# Altium project Sitara_Project_Rev_A.PrjPcb (part 2 of 3)

## Sheet Sitara_IO_Bank_123.SchDoc
size A3; SheetNumber: 7; SheetTotal: 11
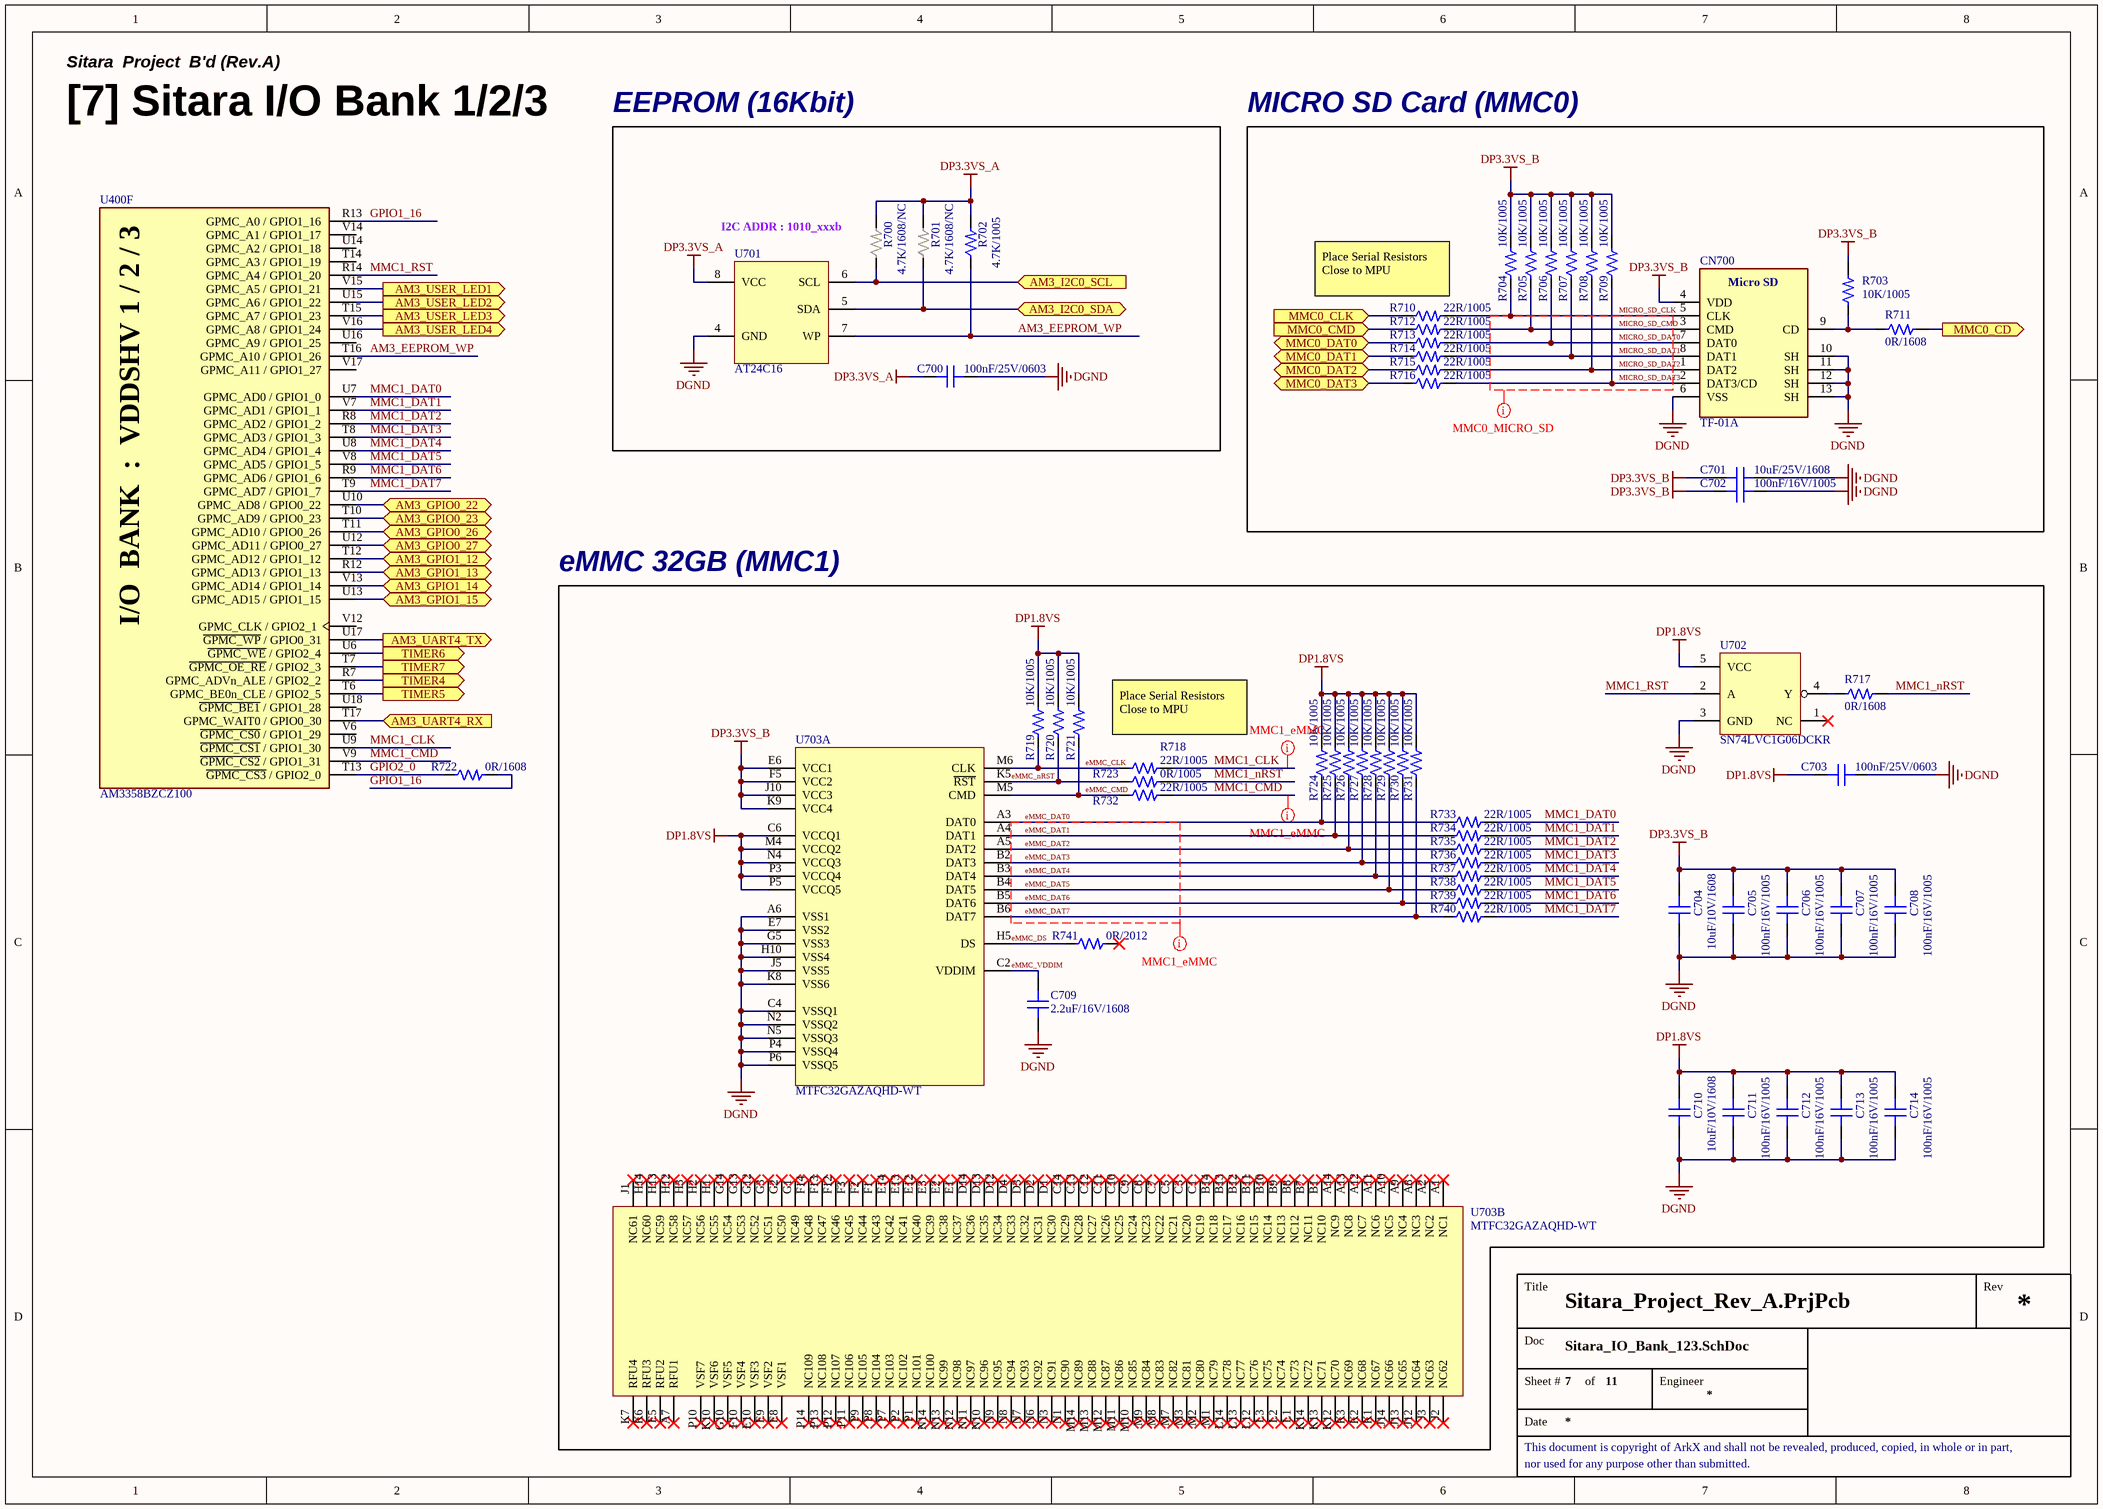
[diagram p6: Sitara_IO_Bank_123.SchDoc]

### Parts
C700  100nF/25V/0603  [CAP 0603 (0201_INCH)]
C701  10uF/25V/1608  [CAP 1608 (0603_INCH)]
C702  100nF/16V/1005  [CAP 1005 (0402_INCH)]
C703  100nF/25V/0603  [CAP 0603 (0201_INCH)]
C704  10uF/10V/1608  [CAP 1608 (0603_INCH)]
C705  100nF/16V/1005  [CAP 1005 (0402_INCH)]
C706  100nF/16V/1005  [CAP 1005 (0402_INCH)]
C707  100nF/16V/1005  [CAP 1005 (0402_INCH)]
C708  100nF/16V/1005  [CAP 1005 (0402_INCH)]
C709  2.2uF/16V/1608  [CAP 1608 (0603_INCH)]
C710  10uF/10V/1608  [CAP 1608 (0603_INCH)]
C711  100nF/16V/1005  [CAP 1005 (0402_INCH)]
C712  100nF/16V/1005  [CAP 1005 (0402_INCH)]
C713  100nF/16V/1005  [CAP 1005 (0402_INCH)]
C714  100nF/16V/1005  [CAP 1005 (0402_INCH)]
CN700  TF-01A  [CON_MICRO-SD_Socket_TF-01A]
R700  4.7K/1608/NC  [RES 1608 (0603_inch)/NC]
R701  4.7K/1608/NC  [RES 1608 (0603_inch)/NC]
R702  4.7K/1005  [RES 1005 (0402_inch)]
R703  10K/1005  [RES 1005 (0402_inch)]
R704  10K/1005  [RES 1005 (0402_inch)]
R705  10K/1005  [RES 1005 (0402_inch)]
R706  10K/1005  [RES 1005 (0402_inch)]
R707  10K/1005  [RES 1005 (0402_inch)]
R708  10K/1005  [RES 1005 (0402_inch)]
R709  10K/1005  [RES 1005 (0402_inch)]
R710  22R/1005  [RES 1005 (0402_inch)]
R711  0R/1608  [RES 1608 (0603_inch)]
R712  22R/1005  [RES 1005 (0402_inch)]
R713  22R/1005  [RES 1005 (0402_inch)]
R714  22R/1005  [RES 1005 (0402_inch)]
R715  22R/1005  [RES 1005 (0402_inch)]
R716  22R/1005  [RES 1005 (0402_inch)]
R717  0R/1608  [RES 1608 (0603_inch)]
R718  22R/1005  [RES 1005 (0402_inch)]
R719  10K/1005  [RES 1005 (0402_inch)]
R720  10K/1005  [RES 1005 (0402_inch)]
R721  10K/1005  [RES 1005 (0402_inch)]
R722  0R/1608  [RES 1608 (0603_inch)]
R723  0R/1005  [RES 1005 (0402_inch)]
R724  10K/1005  [RES 1005 (0402_inch)]
R725  10K/1005  [RES 1005 (0402_inch)]
R726  10K/1005  [RES 1005 (0402_inch)]
R727  10K/1005  [RES 1005 (0402_inch)]
R728  10K/1005  [RES 1005 (0402_inch)]
R729  10K/1005  [RES 1005 (0402_inch)]
R730  10K/1005  [RES 1005 (0402_inch)]
R731  10K/1005  [RES 1005 (0402_inch)]
R732  22R/1005  [RES 1005 (0402_inch)]
R733  22R/1005  [RES 1005 (0402_inch)]
R734  22R/1005  [RES 1005 (0402_inch)]
R735  22R/1005  [RES 1005 (0402_inch)]
R736  22R/1005  [RES 1005 (0402_inch)]
R737  22R/1005  [RES 1005 (0402_inch)]
R738  22R/1005  [RES 1005 (0402_inch)]
R739  22R/1005  [RES 1005 (0402_inch)]
R740  22R/1005  [RES 1005 (0402_inch)]
R741  0R/2012  [RES 2012 (0805_inch)]
U400  AM3358BZCZ100  [IC_SOC_AM3358BZCZ100]  (part F of 8)
U701  AT24C16  [TSSOP-8_PW (TI)]
U702  SN74LVC1G06DCKR  [IC_SC-70-5]
U703  MTFC32GAZAQHD-WT  [IC_VFBGA-153]  (parts A,B of 2)

### Blocks framed on the sheet
EEPROM (16Kbit): C700 R700-R702 U701
MICRO SD Card (MMC0): C701 C702 CN700 R703-R716
eMMC 32GB (MMC1): C703-C714 R717-R721 R723-R741 U702 U703

### Ports
AM3_GPIO0_22 (bidir), AM3_GPIO0_23 (bidir), AM3_GPIO0_26 (bidir), AM3_GPIO0_27 (bidir), AM3_GPIO1_12 (bidir), AM3_GPIO1_13 (bidir), AM3_GPIO1_14 (bidir), AM3_GPIO1_15 (bidir), AM3_I2C0_SCL (in), AM3_I2C0_SDA (bidir), AM3_UART4_RX (in), AM3_UART4_TX (out), AM3_USER_LED1 (out), AM3_USER_LED2 (out), AM3_USER_LED3 (out), AM3_USER_LED4 (out), MMC0_CD (out), MMC0_CLK (in), MMC0_CMD (in), MMC0_DAT0 (bidir), MMC0_DAT1 (bidir), MMC0_DAT2 (bidir), MMC0_DAT3 (bidir), TIMER4 (out), TIMER5 (out), TIMER6 (out), TIMER7 (out)

### Nets
DGND: C700.2 C701.2 C702.1 C703.1 C704.1 C705.1 C706.1 C707.1 C708.1 C709.1 C710.1 C711.1 C712.1 C713.1 C714.1 CN700.6(VSS) CN700.10(SH) CN700.11(SH) CN700.12(SH) CN700.13(SH) U701.4(GND) U702.3(GND) U703.A6(VSS1) U703.C4(VSSQ1) U703.E7(VSS2) U703.G5(VSS3) U703.H10(VSS4) U703.J5(VSS5) U703.K8(VSS6) U703.N2(VSSQ2) U703.N5(VSSQ3) U703.P4(VSSQ4) U703.P6(VSSQ5)
DP1.8VS: C703.2 C710.2 C711.2 C712.2 C713.2 C714.2 R719.2 R720.2 R721.2 R724.2 R725.2 R726.2 R727.2 R728.2 R729.2 R730.2 R731.2 U702.5(VCC) U703.C6(VCCQ1) U703.M4(VCCQ2) U703.N4(VCCQ3) U703.P3(VCCQ4) U703.P5(VCCQ5)
DP3.3VS_A: C700.1 R700.2 R701.2 R702.2 U701.8(VCC)
DP3.3VS_B: C701.1 C702.2 C704.2 C705.2 C706.2 C707.2 C708.2 CN700.4(VDD) R703.2 R704.2 R705.2 R706.2 R707.2 R708.2 R709.2 U703.E6(VCC1) U703.F5(VCC2) U703.J10(VCC3) U703.K9(VCC4)
AM3_EEPROM_WP: R702.1 U400.T16(GPMC_A10_/_GPIO1_26) U701.7(WP)
AM3_GPIO0_22: U400.U10(GPMC_AD8_/_GPIO0_22) ; port AM3_GPIO0_22
AM3_GPIO0_23: U400.T10(GPMC_AD9_/_GPIO0_23) ; port AM3_GPIO0_23
AM3_GPIO0_26: U400.T11(GPMC_AD10_/_GPIO0_26) ; port AM3_GPIO0_26
AM3_GPIO0_27: U400.U12(GPMC_AD11_/_GPIO0_27) ; port AM3_GPIO0_27
AM3_GPIO1_12: U400.T12(GPMC_AD12_/_GPIO1_12) ; port AM3_GPIO1_12
AM3_GPIO1_13: U400.R12(GPMC_AD13_/_GPIO1_13) ; port AM3_GPIO1_13
AM3_GPIO1_14: U400.V13(GPMC_AD14_/_GPIO1_14) ; port AM3_GPIO1_14
AM3_GPIO1_15: U400.U13(GPMC_AD15_/_GPIO1_15) ; port AM3_GPIO1_15
AM3_I2C0_SCL: R700.1 U701.6(SCL) ; port AM3_I2C0_SCL
AM3_I2C0_SDA: R701.1 U701.5(SDA) ; port AM3_I2C0_SDA
AM3_UART4_RX: U400.T17(GPMC_WAIT0_/_GPIO0_30) ; port AM3_UART4_RX
AM3_UART4_TX: U400.U17(~{GPMC_WP}_/_GPIO0_31) ; port AM3_UART4_TX
AM3_USER_LED1: U400.V15(GPMC_A5_/_GPIO1_21) ; port AM3_USER_LED1
AM3_USER_LED2: U400.U15(GPMC_A6_/_GPIO1_22) ; port AM3_USER_LED2
AM3_USER_LED3: U400.T15(GPMC_A7_/_GPIO1_23) ; port AM3_USER_LED3
AM3_USER_LED4: U400.V16(GPMC_A8_/_GPIO1_24) ; port AM3_USER_LED4
eMMC_CLK: R718.1 R719.1 U703.M6(CLK)
eMMC_CMD: R721.1 R732.1 U703.M5(CMD)
eMMC_DAT0: R724.1 R733.1 U703.A3(DAT0)
eMMC_DAT1: R725.1 R734.1 U703.A4(DAT1)
eMMC_DAT2: R726.1 R735.1 U703.A5(DAT2)
eMMC_DAT3: R727.1 R736.1 U703.B2(DAT3)
eMMC_DAT4: R728.1 R737.1 U703.B3(DAT4)
eMMC_DAT5: R729.1 R738.1 U703.B4(DAT5)
eMMC_DAT6: R730.1 R739.1 U703.B5(DAT6)
eMMC_DAT7: R731.1 R740.1 U703.B6(DAT7)
eMMC_DS: R741.1 U703.H5(DS)
eMMC_nRST: R720.1 R723.1 U703.K5(~{RST})
eMMC_VDDIM: C709.2 U703.C2(VDDIM)
GPIO1_16: R722.2 U400.R13(GPMC_A0_/_GPIO1_16)
GPIO2_0: R722.1 U400.T13(~{GPMC_CS3}_/_GPIO2_0)
MICRO_SD_CLK: CN700.5(CLK) R704.1 R710.2
MICRO_SD_CMD: CN700.3(CMD) R705.1 R712.2
MICRO_SD_DAT0: CN700.7(DAT0) R706.1 R713.2
MICRO_SD_DAT1: CN700.8(DAT1) R707.1 R714.2
MICRO_SD_DAT2: CN700.1(DAT2) R708.1 R715.2
MICRO_SD_DAT3: CN700.2(DAT3/CD) R709.1 R716.2
MMC0_CD: R711.2 ; port MMC0_CD
MMC0_CLK: R710.1 ; port MMC0_CLK
MMC0_CMD: R712.1 ; port MMC0_CMD
MMC0_DAT0: R713.1 ; port MMC0_DAT0
MMC0_DAT1: R714.1 ; port MMC0_DAT1
MMC0_DAT2: R715.1 ; port MMC0_DAT2
MMC0_DAT3: R716.1 ; port MMC0_DAT3
MMC1_CLK: R718.2 U400.U9(~{GPMC_CS1}_/_GPIO1_30)
MMC1_CMD: R732.2 U400.V9(~{GPMC_CS2}_/_GPIO1_31)
MMC1_DAT0: R733.2 U400.U7(GPMC_AD0_/_GPIO1_0)
MMC1_DAT1: R734.2 U400.V7(GPMC_AD1_/_GPIO1_1)
MMC1_DAT2: R735.2 U400.R8(GPMC_AD2_/_GPIO1_2)
MMC1_DAT3: R736.2 U400.T8(GPMC_AD3_/_GPIO1_3)
MMC1_DAT4: R737.2 U400.U8(GPMC_AD4_/_GPIO1_4)
MMC1_DAT5: R738.2 U400.V8(GPMC_AD5_/_GPIO1_5)
MMC1_DAT6: R739.2 U400.R9(GPMC_AD6_/_GPIO1_6)
MMC1_DAT7: R740.2 U400.T9(GPMC_AD7_/_GPIO1_7)
MMC1_nRST: R717.2 R723.2
MMC1_RST: U400.R14(GPMC_A4_/_GPIO1_20) U702.2(A)
TIMER4: U400.R7(GPMC_ADVn_ALE_/_GPIO2_2) ; port TIMER4
TIMER5: U400.T6(GPMC_BE0n_CLE_/_GPIO2_5) ; port TIMER5
TIMER6: U400.U6(~{GPMC_WE}_/_GPIO2_4) ; port TIMER6
TIMER7: U400.T7(~{GPMC_OE_RE}_/_GPIO2_3) ; port TIMER7
NetCN700_9: CN700.9(CD) R703.1 R711.1
NetR717_1: R717.1 U702.4(Y)

Not connected (* = marked no-connect by the designer): R741 2*; U400 T14(GPMC_A3_/_GPIO1_19) U14(GPMC_A2_/_GPIO1_18) U16(GPMC_A9_/_GPIO1_25) U18(~{GPMC_BE1}_/_GPIO1_28) V6(~{GPMC_CS0}_/_GPIO1_29) V12(GPMC_CLK_/_GPIO2_1) V14(GPMC_A1_/_GPIO1_17) V17(GPMC_A11_/_GPIO1_27); U702 1(NC)*; U703 A1(NC1)* A2(NC2)* A7(RFU1)* A8(NC3)* A9(NC4)* A10(NC5)* A11(NC6)* A12(NC7)* A13(NC8)* A14(NC9)* B1(NC10)* B7(NC11)* B8(NC12)* B9(NC13)* B10(NC14)* B11(NC15)* B12(NC16)* B13(NC17)* B14(NC18)* C1(NC19)* C3(NC20)* C5(NC21)* C7(NC22)* C8(NC23)* C9(NC24)* C10(NC25)* C11(NC26)* C12(NC27)* C13(NC28)* C14(NC29)* D1(NC30)* D2(NC31)* D3(NC32)* D4(NC33)* D12(NC34)* D13(NC35)* D14(NC36)* E1(NC37)* E2(NC38)* E3(NC39)* E5(RFU2)* E8(VSF1)* E9(VSF2)* E10(VSF3)* E12(NC40)* E13(NC41)* E14(NC42)* F1(NC43)* F2(NC44)* F3(NC45)* F10(VSF4)* F12(NC46)* F13(NC47)* F14(NC48)* G1(NC49)* G2(NC50)* G3(NC51)* G10(VSF5)* G12(NC52)* G13(NC53)* G14(NC54)* H1(NC55)* H2(NC56)* H3(NC57)* H12(NC58)* H13(NC59)* H14(NC60)* J1(NC61)* J2(NC62)* J3(NC63)* J12(NC64)* J13(NC65)* J14(NC66)* K1(NC67)* K2(NC68)* K3(NC69)* K6(RFU3)* K7(RFU4)* K10(VSF6)* K12(NC70)* K13(NC71)* K14(NC72)* L1(NC73)* L2(NC74)* L3(NC75)* L12(NC76)* L13(NC77)* L14(NC78)* M1(NC79)* M2(NC80)* M3(NC81)* M7(NC82)* M8(NC83)* M9(NC84)* M10(NC85)* M11(NC86)* M12(NC87)* M13(NC88)* M14(NC89)* N1(NC90)* N3(NC91)* N6(NC92)* N7(NC93)* N8(NC94)* N9(NC95)* N10(NC96)* N11(NC97)* N12(NC98)* N13(NC99)* N14(NC100)* P1(NC101)* P2(NC102)* P7(NC103)* P8(NC104)* P9(NC105)* P10(VSF7)* P11(NC106)* P12(NC107)* P13(NC108)* P14(NC109)*

### Layout directives
rule Matched Net Lengths [Delay Tolerance = 10ps]; net class MMC0_MICRO_SD: MICRO_SD_CLK, MICRO_SD_CMD, MICRO_SD_DAT0, MICRO_SD_DAT1, MICRO_SD_DAT2, MICRO_SD_DAT3
rule Matched Net Lengths [Delay Tolerance = 10ps]; net class MMC1_eMMC: eMMC_DAT0, eMMC_DAT1, eMMC_DAT2, eMMC_DAT3, eMMC_DAT4, eMMC_DAT5, eMMC_DAT6, eMMC_DAT7, MMC1_CLK, MMC1_CMD

### Notes on the sheet
- Sitara  Project  B'd (Rev.A)
- [7] Sitara I/O Bank 1/2/3
- I2C ADDR : 1010_xxxb
- Place Serial Resistors Close to MPU
- Title
- Rev
- Doc
- Sheet #
- of
- Engineer
- This document is copyright of ArkX and shall not be revealed, produced, copied, in whole or in part,
- Date
- nor used for any purpose other than submitted.
- (in symbol CON_MICRO-SD_Socket_TF-01A) Micro SD
- (in symbol IC_SOC_AM3358BZCZ100, part F) I/O  BANK  :  VDDSHV 1 / 2 / 3

### Library data of the parts
C700 C703 = CAP_100nF/25V/0603: Ceramic CAP_100nF/25V/0603; JLCPCB Part Type: Extended Part; LCSC Part #: C181047
C701 = CAP_10uF/25V/1608: Ceramic CAP_10uF/25V/1608; LCSC Part #: C96446; JLCPCB Part Type: Basic Part
C702 C705-C708 C711-C714 = CAP_100nF/16V/1005: Ceramic CAP_100nF/16V/1005; LCSC Part #: C1525; JLCPCB Part Type: Basic Part
C704 C710 = CAP_10uF/10V/1608: Ceramic CAP_10uF/10V/1608; LCSC Part #: C19702; JLCPCB Part Type: Basic Part
C709 = CAP_2.2uF/16V/1608: Ceramic CAP_2.2uF/16V/1608; LCSC Part #: C23630; JLCPCB Part Type: Basic Part
CN700 = CON_MICRO-SD_Socket_TF-01A: Card Slot MicroSD card (TF card) Self-bouncing SMD SD Card / Memory Card Connector ROHS; LCSC Part #: C91145; JLCPCB Part Type: Extended Part
R700 R701 = RES_NC_4.7K/1608/0.1W: RES_4.7K/1608/0.1W; Value: 4.7K; Power Rating: 0.1W; Precision: 1%; Size: 1608
R702 = RES_4.7K/1005/62.5mW: as R519 on sheet Sitara_AUX; Size: 1005; LCSC Part #: C25900; JLCPCB Part Type: Basic Part
R703-R709 R719-R721 R724-R731 = RES_10K/1005/62.5mW: Value: 10K; Power Rating: 62.5mW; Precision: 1%; Size: 1005; LCSC Part #: C25744; JLCPCB Part Type: Basic Part
R710 R712-R716 R718 R732-R740 = RES_22R/1005/62.5mW: Value: 22R; Power Rating: 62.5mW; Precision: 1%; Size: 1005; LCSC Part #: C25092; JLCPCB Part Type: Basic Part
R711 R717 R722 = RES_0R/1608/0.1W: as R322 on sheet Power; Size: 1608; LCSC Part #: C21189; JLCPCB Part Type: Basic Part
R723 = RES_0R/1005/62.5mW: as R308 on sheet Power; Size: 1005; LCSC Part #: C17168; JLCPCB Part Type: Basic Part
R741 = RES_0R/2012/0.125W: as R310 on sheet Power; Size: 2012; LCSC Part #: C17477; JLCPCB Part Type: Basic Part
U400 = IC_SOC_AM3358BZCZ100: as U400 on sheet Sitara_Power; LCSC Part #: C73932; JLCPCB Part Type: Extended Part
U701 = IC_EEPROM_AT24C16: IC EEPROM 16KBIT I2C 1MHZ 8TSSOP; LCSC Part #: C112954; JLCPCB Part Type: Extended Part
U702 = IC_BUF_SN74LVC1G06DCKR: Inverter IC 1 Channel Open Drain SC-70-5; LCSC Part #: C7828; JLCPCB Part Type: Extended Part
U703 = IC_eMMC_MTFC32GAZAQHD-WT: FLASH - NAND Memory IC 256Gbit MMC 200 MHz 153-VFBGA (11.5x13); LCSC Part #: C5330430; JLCPCB Part Type: Extended Part

## Sheet Sitara_IO_Bank_45.SchDoc
size A3; SheetNumber: 8; SheetTotal: 11
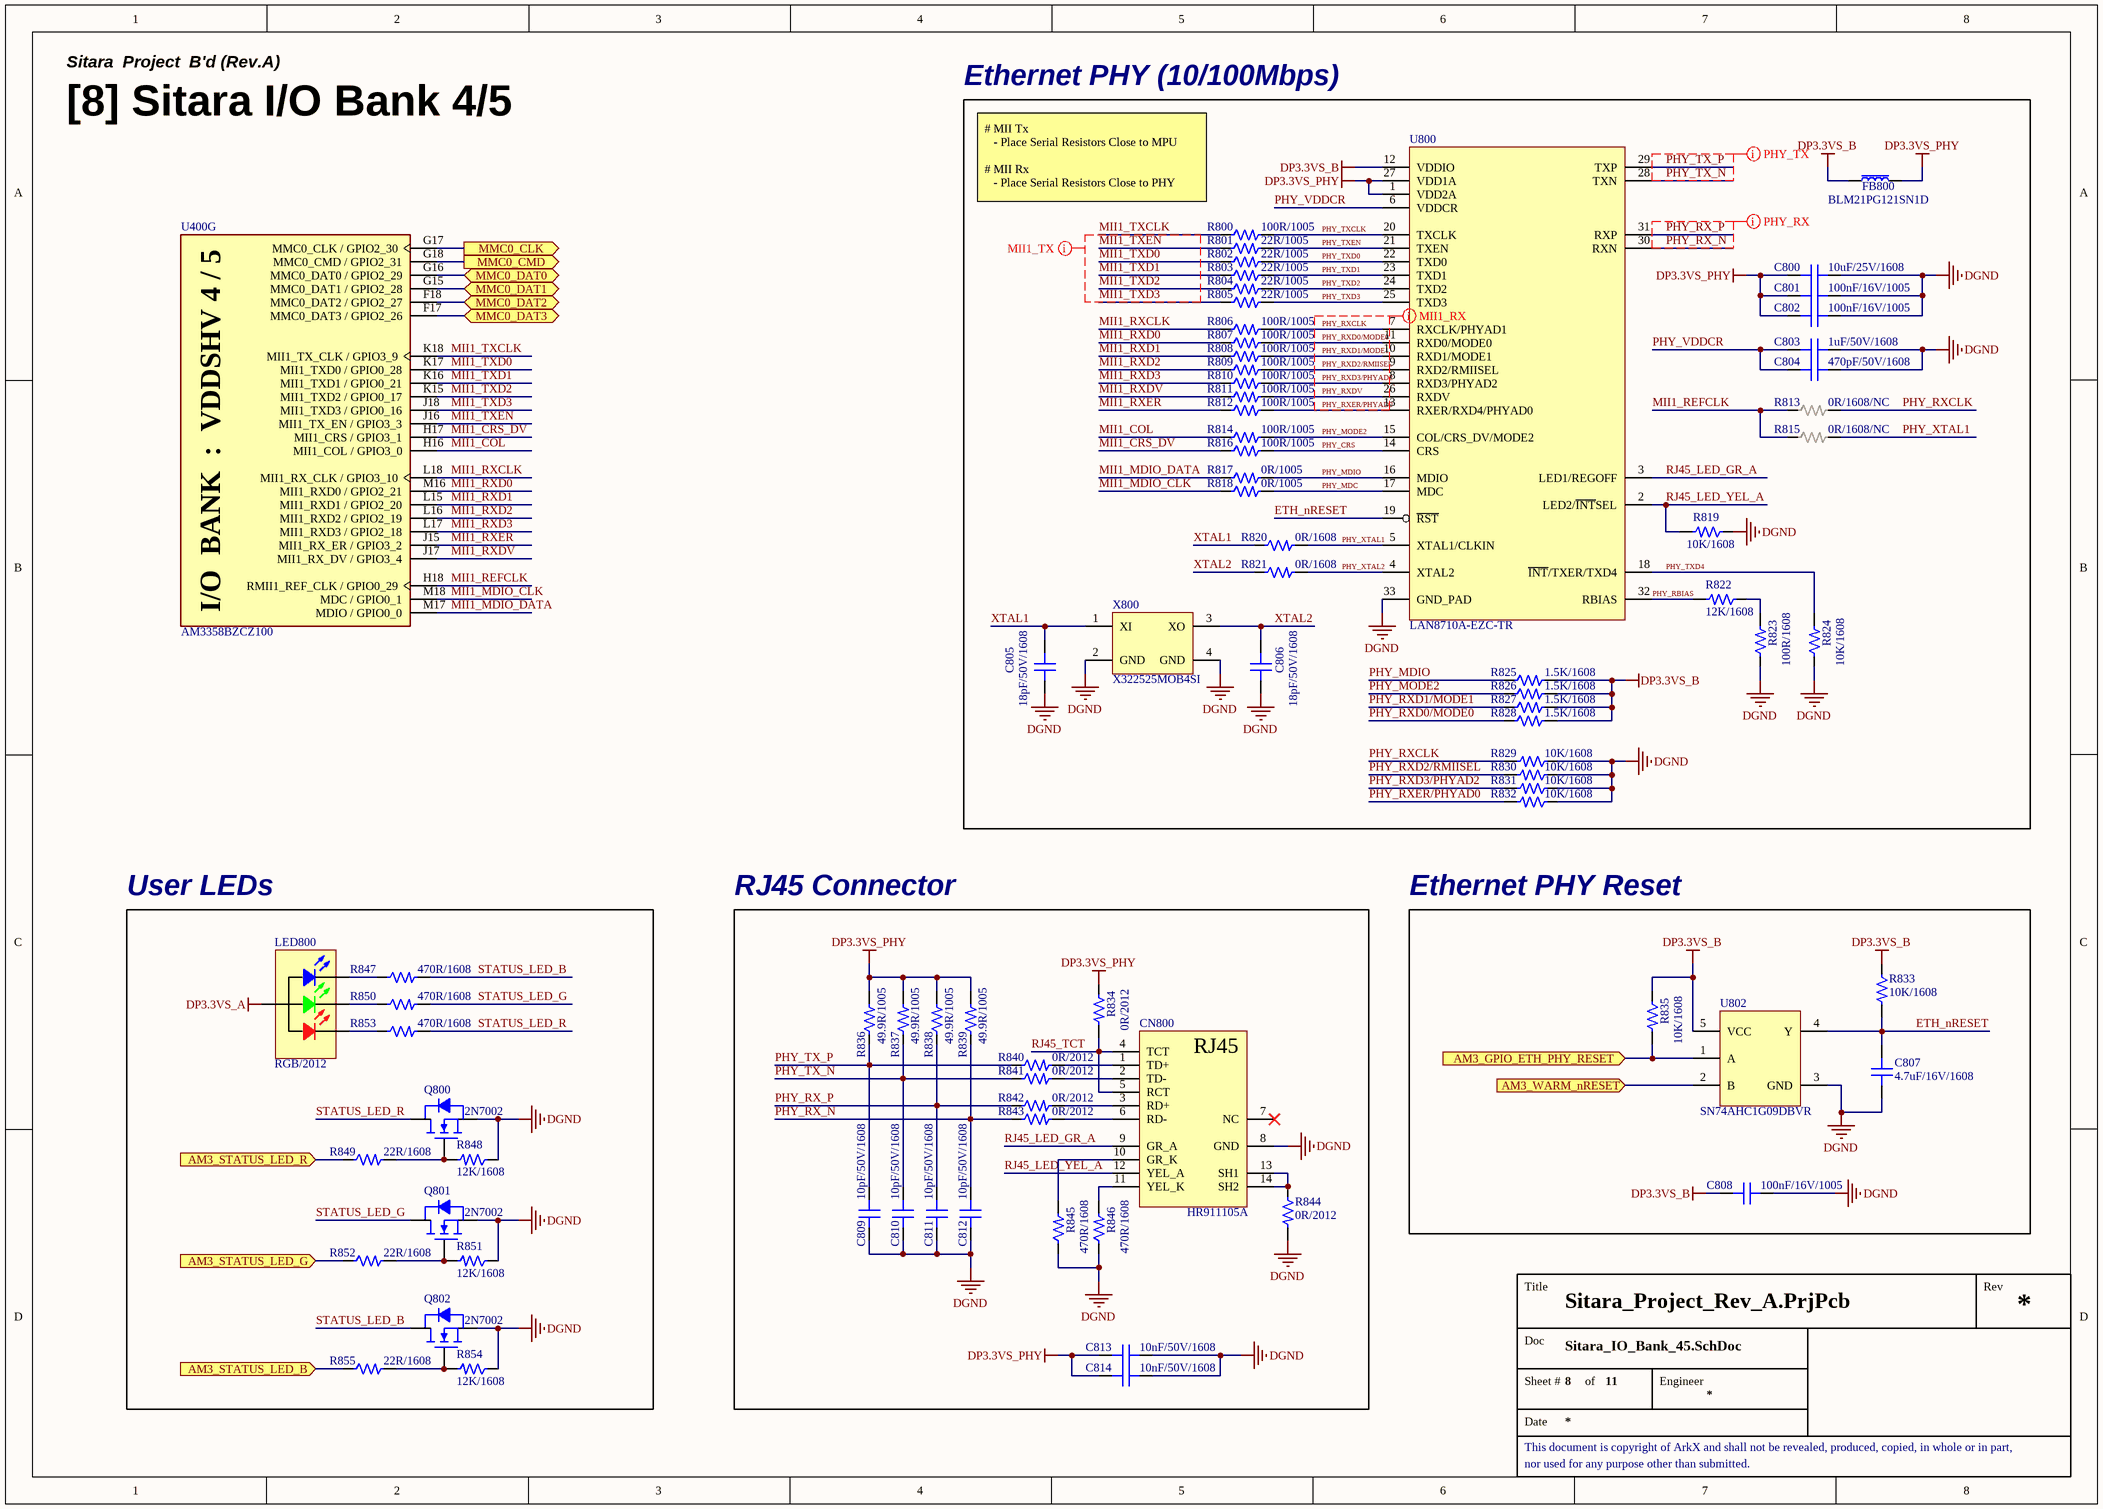
[diagram p7: Sitara_IO_Bank_45.SchDoc]

### Parts
C800  10uF/25V/1608  [CAP 1608 (0603_INCH)]
C801  100nF/16V/1005  [CAP 1005 (0402_INCH)]
C802  100nF/16V/1005  [CAP 1005 (0402_INCH)]
C803  1uF/50V/1608  [CAP 1608 (0603_INCH)]
C804  470pF/50V/1608  [CAP 1608 (0603_INCH)]
C805  18pF/50V/1608  [CAP 1608 (0603_INCH)]
C806  18pF/50V/1608  [CAP 1608 (0603_INCH)]
C807  4.7uF/16V/1608  [CAP 1608 (0603_INCH)]
C808  100nF/16V/1005  [CAP 1005 (0402_INCH)]
C809  10pF/50V/1608  [CAP 1608 (0603_INCH)]
C810  10pF/50V/1608  [CAP 1608 (0603_INCH)]
C811  10pF/50V/1608  [CAP 1608 (0603_INCH)]
C812  10pF/50V/1608  [CAP 1608 (0603_INCH)]
C813  10nF/50V/1608  [CAP 1608 (0603_INCH)]
C814  10nF/50V/1608  [CAP 1608 (0603_INCH)]
CN800  HR911105A  [CON_RJ45]
FB800  BLM21PG121SN1D  [FB 2012 (0805_inch)]
LED800  RGB/2012  [LED MHT170RGBCT]
Q800  2N7002  [SOT 23-3 (DIODES INCORPORATED)]
Q801  2N7002  [SOT 23-3 (DIODES INCORPORATED)]
Q802  2N7002  [SOT 23-3 (DIODES INCORPORATED)]
R800  100R/1005  [RES 1005 (0402_inch)]
R801  22R/1005  [RES 1005 (0402_inch)]
R802  22R/1005  [RES 1005 (0402_inch)]
R803  22R/1005  [RES 1005 (0402_inch)]
R804  22R/1005  [RES 1005 (0402_inch)]
R805  22R/1005  [RES 1005 (0402_inch)]
R806  100R/1005  [RES 1005 (0402_inch)]
R807  100R/1005  [RES 1005 (0402_inch)]
R808  100R/1005  [RES 1005 (0402_inch)]
R809  100R/1005  [RES 1005 (0402_inch)]
R810  100R/1005  [RES 1005 (0402_inch)]
R811  100R/1005  [RES 1005 (0402_inch)]
R812  100R/1005  [RES 1005 (0402_inch)]
R813  0R/1608/NC  [RES 1608 (0603_inch)/NC]
R814  100R/1005  [RES 1005 (0402_inch)]
R815  0R/1608/NC  [RES 1608 (0603_inch)/NC]
R816  100R/1005  [RES 1005 (0402_inch)]
R817  0R/1005  [RES 1005 (0402_inch)]
R818  0R/1005  [RES 1005 (0402_inch)]
R819  10K/1608  [RES 1608 (0603_inch)]
R820  0R/1608  [RES 1608 (0603_inch)]
R821  0R/1608  [RES 1608 (0603_inch)]
R822  12K/1608  [RES 1608 (0603_inch)]
R823  100R/1608  [RES 1608 (0603_inch)]
R824  10K/1608  [RES 1608 (0603_inch)]
R825  1.5K/1608  [RES 1608 (0603_inch)]
R826  1.5K/1608  [RES 1608 (0603_inch)]
R827  1.5K/1608  [RES 1608 (0603_inch)]
R828  1.5K/1608  [RES 1608 (0603_inch)]
R829  10K/1608  [RES 1608 (0603_inch)]
R830  10K/1608  [RES 1608 (0603_inch)]
R831  10K/1608  [RES 1608 (0603_inch)]
R832  10K/1608  [RES 1608 (0603_inch)]
R833  10K/1608  [RES 1608 (0603_inch)]
R834  0R/2012  [RES 2012 (0805_inch)]
R835  10K/1608  [RES 1608 (0603_inch)]
R836  49.9R/1005  [RES 1005 (0402_inch)]
R837  49.9R/1005  [RES 1005 (0402_inch)]
R838  49.9R/1005  [RES 1005 (0402_inch)]
R839  49.9R/1005  [RES 1005 (0402_inch)]
R840  0R/2012  [RES 2012 (0805_inch)]
R841  0R/2012  [RES 2012 (0805_inch)]
R842  0R/2012  [RES 2012 (0805_inch)]
R843  0R/2012  [RES 2012 (0805_inch)]
R844  0R/2012  [RES 2012 (0805_inch)]
R845  470R/1608  [RES 1608 (0603_inch)]
R846  470R/1608  [RES 1608 (0603_inch)]
R847  470R/1608  [RES 1608 (0603_inch)]
R848  12K/1608  [RES 1608 (0603_inch)]
R849  22R/1608  [RES 1608 (0603_inch)]
R850  470R/1608  [RES 1608 (0603_inch)]
R851  12K/1608  [RES 1608 (0603_inch)]
R852  22R/1608  [RES 1608 (0603_inch)]
R853  470R/1608  [RES 1608 (0603_inch)]
R854  12K/1608  [RES 1608 (0603_inch)]
R855  22R/1608  [RES 1608 (0603_inch)]
U400  AM3358BZCZ100  [IC_SOC_AM3358BZCZ100]  (part G of 8)
U800  LAN8710A-EZC-TR  [IC_QFN-32 (5x5)]
U802  SN74AHC1G09DBVR  [SOT-23-5 (TI DBV PACKAGE)]
X800  X322525MOB4SI  [OSC_SMD_3.2x2.5(YXC)]

### Blocks framed on the sheet
Ethernet PHY (10/100Mbps): C800-C806 FB800 R800-R832 U800 X800
User LEDs: LED800 Q800-Q802 R847-R855
RJ45 Connector: C809-C814 CN800 R834 R836-R846
Ethernet PHY Reset: C807 C808 R833 R835 U802

### Ports
AM3_GPIO_ETH_PHY_RESET (in), AM3_STATUS_LED_B (in), AM3_STATUS_LED_G (in), AM3_STATUS_LED_R (in), AM3_WARM_nRESET (in), MMC0_CLK (out), MMC0_CMD (out), MMC0_DAT0 (bidir), MMC0_DAT1 (bidir), MMC0_DAT2 (bidir), MMC0_DAT3 (bidir)

### Nets
DGND: C800.2 C801.2 C802.2 C803.2 C804.2 C805.1 C806.1 C807.1 C808.2 C809.1 C810.1 C811.1 C812.1 C813.2 C814.2 CN800.8(GND) Q800.2(S) Q801.2(S) Q802.2(S) R819.1 R823.1 R824.1 R829.1 R830.1 R831.1 R832.1 R844.2 R845.1 R846.1 R848.1 R851.1 R854.1 U800.33(GND_PAD) U802.3(GND) X800.2(GND) X800.4(GND)
DP3.3VS_A: LED800.4(Common_Anode)
DP3.3VS_B: C808.1 FB800.1 R825.2 R826.2 R827.2 R828.2 R833.1 R835.1 U800.12(VDDIO) U802.5(VCC)
DP3.3VS_PHY: C800.1 C801.1 C802.1 C813.1 C814.1 FB800.2 R834.1 R836.2 R837.2 R838.2 R839.2 U800.1(VDD2A) U800.27(VDD1A)
AM3_GPIO_ETH_PHY_RESET: R835.2 U802.1(A) ; port AM3_GPIO_ETH_PHY_RESET
AM3_STATUS_LED_B: R855.1 ; port AM3_STATUS_LED_B
AM3_STATUS_LED_G: R852.1 ; port AM3_STATUS_LED_G
AM3_STATUS_LED_R: R849.1 ; port AM3_STATUS_LED_R
AM3_WARM_nRESET: U802.2(B) ; port AM3_WARM_nRESET
ETH_nRESET: C807.2 R833.2 U800.19(~{RST}) U802.4(Y)
MII1_COL: R814.1 U400.H16(MII1_COL_/_GPIO3_0)
MII1_CRS_DV: R816.1 U400.H17(MII1_CRS_/_GPIO3_1)
MII1_MDIO_CLK: R818.1 U400.M18(MDC_/_GPIO0_1)
MII1_MDIO_DATA: R817.1 U400.M17(MDIO_/_GPIO0_0)
MII1_REFCLK: R813.1 R815.1 U400.H18(RMII1_REF_CLK_/_GPIO0_29)
MII1_RXCLK: R806.1 U400.L18(MII1_RX_CLK_/_GPIO3_10)
MII1_RXD0: R807.1 U400.M16(MII1_RXD0_/_GPIO2_21)
MII1_RXD1: R808.1 U400.L15(MII1_RXD1_/_GPIO2_20)
MII1_RXD2: R809.1 U400.L16(MII1_RXD2_/_GPIO2_19)
MII1_RXD3: R810.1 U400.L17(MII1_RXD3_/_GPIO2_18)
MII1_RXDV: R811.1 U400.J17(MII1_RX_DV_/_GPIO3_4)
MII1_RXER: R812.1 U400.J15(MII1_RX_ER_/_GPIO3_2)
MII1_TXCLK: R800.1 U400.K18(MII1_TX_CLK_/_GPIO3_9)
MII1_TXD0: R802.1 U400.K17(MII1_TXD0_/_GPIO0_28)
MII1_TXD1: R803.1 U400.K16(MII1_TXD1_/_GPIO0_21)
MII1_TXD2: R804.1 U400.K15(MII1_TXD2_/_GPIO0_17)
MII1_TXD3: R805.1 U400.J18(MII1_TXD3_/_GPIO0_16)
MII1_TXEN: R801.1 U400.J16(MII1_TX_EN_/_GPIO3_3)
MMC0_CLK: U400.G17(MMC0_CLK_/_GPIO2_30) ; port MMC0_CLK
MMC0_CMD: U400.G18(MMC0_CMD_/_GPIO2_31) ; port MMC0_CMD
MMC0_DAT0: U400.G16(MMC0_DAT0_/_GPIO2_29) ; port MMC0_DAT0
MMC0_DAT1: U400.G15(MMC0_DAT1_/_GPIO2_28) ; port MMC0_DAT1
MMC0_DAT2: U400.F18(MMC0_DAT2_/_GPIO2_27) ; port MMC0_DAT2
MMC0_DAT3: U400.F17(MMC0_DAT3_/_GPIO2_26) ; port MMC0_DAT3
PHY_CRS: R816.2 U800.14(CRS)
PHY_MDC: R818.2 U800.17(MDC)
PHY_MDIO: R817.2 R825.1 U800.16(MDIO)
PHY_MODE2: R814.2 R826.1 U800.15(COL/CRS_DV/MODE2)
PHY_RBIAS: R822.2 U800.32(RBIAS)
PHY_RX_N: C812.2 R839.1 R843.1 U800.30(RXN)
PHY_RX_P: C811.2 R838.1 R842.1 U800.31(RXP)
PHY_RXCLK: R806.2 R813.2 R829.2 U800.7(RXCLK/PHYAD1)
PHY_RXD0/MODE0: R807.2 R828.1 U800.11(RXD0/MODE0)
PHY_RXD1/MODE1: R808.2 R827.1 U800.10(RXD1/MODE1)
PHY_RXD2/RMIISEL: R809.2 R830.2 U800.9(RXD2/RMIISEL)
PHY_RXD3/PHYAD2: R810.2 R831.2 U800.8(RXD3/PHYAD2)
PHY_RXDV: R811.2 U800.26(RXDV)
PHY_RXER/PHYAD0: R812.2 R832.2 U800.13(RXER/RXD4/PHYAD0)
PHY_TX_N: C810.2 R837.1 R841.1 U800.28(TXN)
PHY_TX_P: C809.2 R836.1 R840.1 U800.29(TXP)
PHY_TXCLK: R800.2 U800.20(TXCLK)
PHY_TXD0: R802.2 U800.22(TXD0)
PHY_TXD1: R803.2 U800.23(TXD1)
PHY_TXD2: R804.2 U800.24(TXD2)
PHY_TXD3: R805.2 U800.25(TXD3)
PHY_TXD4: R824.2 U800.18(~{INT}/TXER/TXD4)
PHY_TXEN: R801.2 U800.21(TXEN)
PHY_VDDCR: C803.1 C804.1 U800.6(VDDCR)
PHY_XTAL1: R815.2 R820.2 U800.5(XTAL1/CLKIN)
PHY_XTAL2: R821.2 U800.4(XTAL2)
RJ45_LED_GR_A: CN800.9(GR_A) U800.3(LED1/REGOFF)
RJ45_LED_YEL_A: CN800.12(YEL_A) R819.2 U800.2(LED2/~{INT}SEL)
RJ45_TCT: CN800.4(TCT) CN800.5(RCT) R834.2
STATUS_LED_B: Q802.3(D) R847.2
STATUS_LED_G: Q801.3(D) R850.2
STATUS_LED_R: Q800.3(D) R853.2
XTAL1: C805.2 R820.1 X800.1(XI)
XTAL2: C806.2 R821.1 X800.3(XO)
NetCN800_1: CN800.1(TD+) R840.2
NetCN800_2: CN800.2(TD-) R841.2
NetCN800_3: CN800.3(RD+) R842.2
NetCN800_6: CN800.6(RD-) R843.2
NetCN800_10: CN800.10(GR_K) R845.2
NetCN800_11: CN800.11(YEL_K) R846.2
NetCN800_13: CN800.13(SH1) CN800.14(SH2) R844.1
NetLED800_1: LED800.1(RED) R853.1
NetLED800_2: LED800.2(GREEN) R850.1
NetLED800_3: LED800.3(BLUE) R847.1
NetQ800_1: Q800.1(G) R848.2 R849.2
NetQ801_1: Q801.1(G) R851.2 R852.2
NetQ802_1: Q802.1(G) R854.2 R855.2
NetR822_1: R822.1 R823.2

Not connected (* = marked no-connect by the designer): CN800 7(NC)*

### Layout directives
differential pair; differential pair class PHY_TX; rule Matched Net Lengths [Delay Tolerance = 10ps]: PHY_TX_N, PHY_TX_P
differential pair; differential pair class PHY_RX; rule Matched Net Lengths [Delay Tolerance = 10ps]: PHY_RX_N, PHY_RX_P
rule Matched Net Lengths [Delay Tolerance = 10ps]; net class MII1_TX: MII1_TXCLK, MII1_TXD0, MII1_TXD1, MII1_TXD2, MII1_TXD3, MII1_TXEN
rule Matched Net Lengths [Delay Tolerance = 10ps]; net class MII1_RX: PHY_RXCLK, PHY_RXD0/MODE0, PHY_RXD1/MODE1, PHY_RXD2/RMIISEL, PHY_RXD3/PHYAD2, PHY_RXDV, PHY_RXER/PHYAD0

### Notes on the sheet
- Sitara  Project  B'd (Rev.A)
- [8] Sitara I/O Bank 4/5
- # MII Tx
  - Place Serial Resistors Close to MPU
  # MII Rx
  - Place Serial Resistors Close to PHY
- Title
- Rev
- Doc
- Sheet #
- of
- Engineer
- This document is copyright of ArkX and shall not be revealed, produced, copied, in whole or in part,
- Date
- nor used for any purpose other than submitted.
- (in symbol CON_RJ45_HR911105A) RJ45
- (in symbol IC_SOC_AM3358BZCZ100, part G) I/O  BANK  :  VDDSHV 4 / 5

### Library data of the parts
C800 = CAP_10uF/25V/1608: Ceramic CAP_10uF/25V/1608; LCSC Part #: C96446; JLCPCB Part Type: Basic Part
C801 C802 C808 = CAP_100nF/16V/1005: Ceramic CAP_100nF/16V/1005; LCSC Part #: C1525; JLCPCB Part Type: Basic Part
C803 = CAP_1uF/50V/1608: Ceramic CAP_1uF/50V/1608; LCSC Part #: C15849; JLCPCB Part Type: Basic Part
C804 = CAP_470pF/50V/1608: Ceramic CAP_470pF/50V/1608; LCSC Part #: C1620; JLCPCB Part Type: Basic Part
C805 C806 = CAP_18pF/50V/1608: Ceramic CAP_18pF/50V/1608; LCSC Part #: C1647; JLCPCB Part Type: Basic Part
C807 = CAP_4.7uF/16V/1608: Ceramic CAP_4.7uF/16V/1608; LCSC Part #: C19666; JLCPCB Part Type: Basic Part
C809-C812 = CAP_10pF/50V/1608: Ceramic CAP_10pF/50V/1608; LCSC Part #: C1634; JLCPCB Part Type: Basic Part
C813 C814 = CAP_10nF/50V/1608: Ceramic CAP_10nF/50V/1608; LCSC Part #: C57112; JLCPCB Part Type: Basic Part
CN800 = CON_RJ45_HR911105A: RJ45Receptacle 1 WithLED Plugin Ethernet Connectors / Modular Connectors (RJ45 RJ11) ROHS; LCSC Part #: C12074; JLCPCB Part Type: Extended Part
FB800 = FB_BLM21PG121SN1D: 3A 1 30mΩ 120Ω@100MHz ±25% 0805  Ferrite Beads ROHS; LCSC Part #: C79382; JLCPCB Part Type: Extended Part
LED800 = LED_RGB_MHT170RGBCT: Colorless transparence -30℃~+85℃ Positive post Common anode RGB 120° 0805  Light Emitting Diodes (LED) ROHS; LCSC Part #: C2962094; JLCPCB Part Type: Extended Part
Q800-Q802 = FET_2N7002: 60V 115mA 200mW 7.5Ω@10V,500mA N Channel SOT-23  MOSFETs ROHS; LCSC Part #: C8545; JLCPCB Part Type: Basic Part
R800 R806-R812 R814 R816 = RES_100R/1005/62.5mW: Value: 100R; Power Rating: 62.5mW; Precision: 1%; Size: 1005; LCSC Part #: C25076; JLCPCB Part Type: Basic Part
R801-R805 = RES_22R/1005/62.5mW: Value: 22R; Power Rating: 62.5mW; Precision: 1%; Size: 1005; LCSC Part #: C25092; JLCPCB Part Type: Basic Part
R813 R815 = RES_NC_0R/1608/0.1W: 0R/1608/0.1W/NC; Value: 0R; Power Rating: 0.1W; Precision: 1%; Size: 1608
R817 R818 = RES_0R/1005/62.5mW: Value: 0R; Power Rating: 62.5mW; Precision: 1%; Size: 1005; LCSC Part #: C17168; JLCPCB Part Type: Basic Part
R819 R824 R829-R833 R835 = RES_10K/1608/0.1W: Value: 10K; Power Rating: 0.1W; Precision: 1%; Size: 1608; LCSC Part #: C25804; JLCPCB Part Type: Basic Part
R820 R821 = RES_0R/1608/0.1W: Value: 0R; Power Rating: 0.1W; Precision: 1%; Size: 1608; LCSC Part #: C21189; JLCPCB Part Type: Basic Part
R822 R848 R851 R854 = RES_12K/1608/0.1W: Value: 12K; Power Rating: 0.1W; Precision: 1%; Size: 1608; LCSC Part #: C22790; JLCPCB Part Type: Basic Part
R823 = RES_100R/1608/0.1W: Value: 100R; Power Rating: 0.1W; Precision: 1%; Size: 1608; LCSC Part #: C22775; JLCPCB Part Type: Basic Part
R825-R828 = RES_1.5K/1608/0.1W: Value: 1.5K; Power Rating: 0.1W; Precision: 1%; Size: 1608; LCSC Part #: C22843; JLCPCB Part Type: Basic Part
R834 R840-R844 = RES_0R/2012/0.125W: Value: 0R; Power Rating: 0.125W; Precision: 1%; Size: 2012; LCSC Part #: C17477; JLCPCB Part Type: Basic Part
R836-R839 = RES_49.9R/1005/62.5mW: Value: 49.9R; Power Rating: 62.5mW; Precision: 1%; Size: 1005; LCSC Part #: C25120; JLCPCB Part Type: Basic Part
R845-R847 R850 R853 = RES_470R/1608/0.1W: Value: 470R; Power Rating: 0.1W; Precision: 1%; Size: 1608; LCSC Part #: C23179; JLCPCB Part Type: Basic Part
R849 R852 R855 = RES_22R/1608/0.1W: Value: 22R; Power Rating: 0.1W; Precision: 1%; Size: 1608; LCSC Part #: C23345; JLCPCB Part Type: Basic Part
U400 = IC_SOC_AM3358BZCZ100: ARM® Cortex®-A8 Microprocessor IC Sitara™ 1 Core, 32-Bit 1.0GHz 324-NFBGA (15x15); LCSC Part #: C73932; JLCPCB Part Type: Extended Part
U800 = IC_ETH_LAN8710A-EZC-TR: 4/4 Transceiver Full MII, RMII 32-QFN (5x5); LCSC Part #: C46185; JLCPCB Part Type: Extended Part
U802 = IC_AND_SN74AHC1G09DBVR: AND Gate IC 1 Channel Open Drain SOT-23-5; LCSC Part #: C840099; JLCPCB Part Type: Extended Part
X800 = XTAL_25MHz_X322525MOB4SI: 25MHz Surface Mount Crystal 12pF ±10ppm ±20ppm SMD3225-4P Crystals ROHS; LCSC Part #: C9006; JLCPCB Part Type: Basic Part

## Sheet Sitara_IO_Bank_6.SchDoc
size A3; SheetNumber: 9; SheetTotal: 11
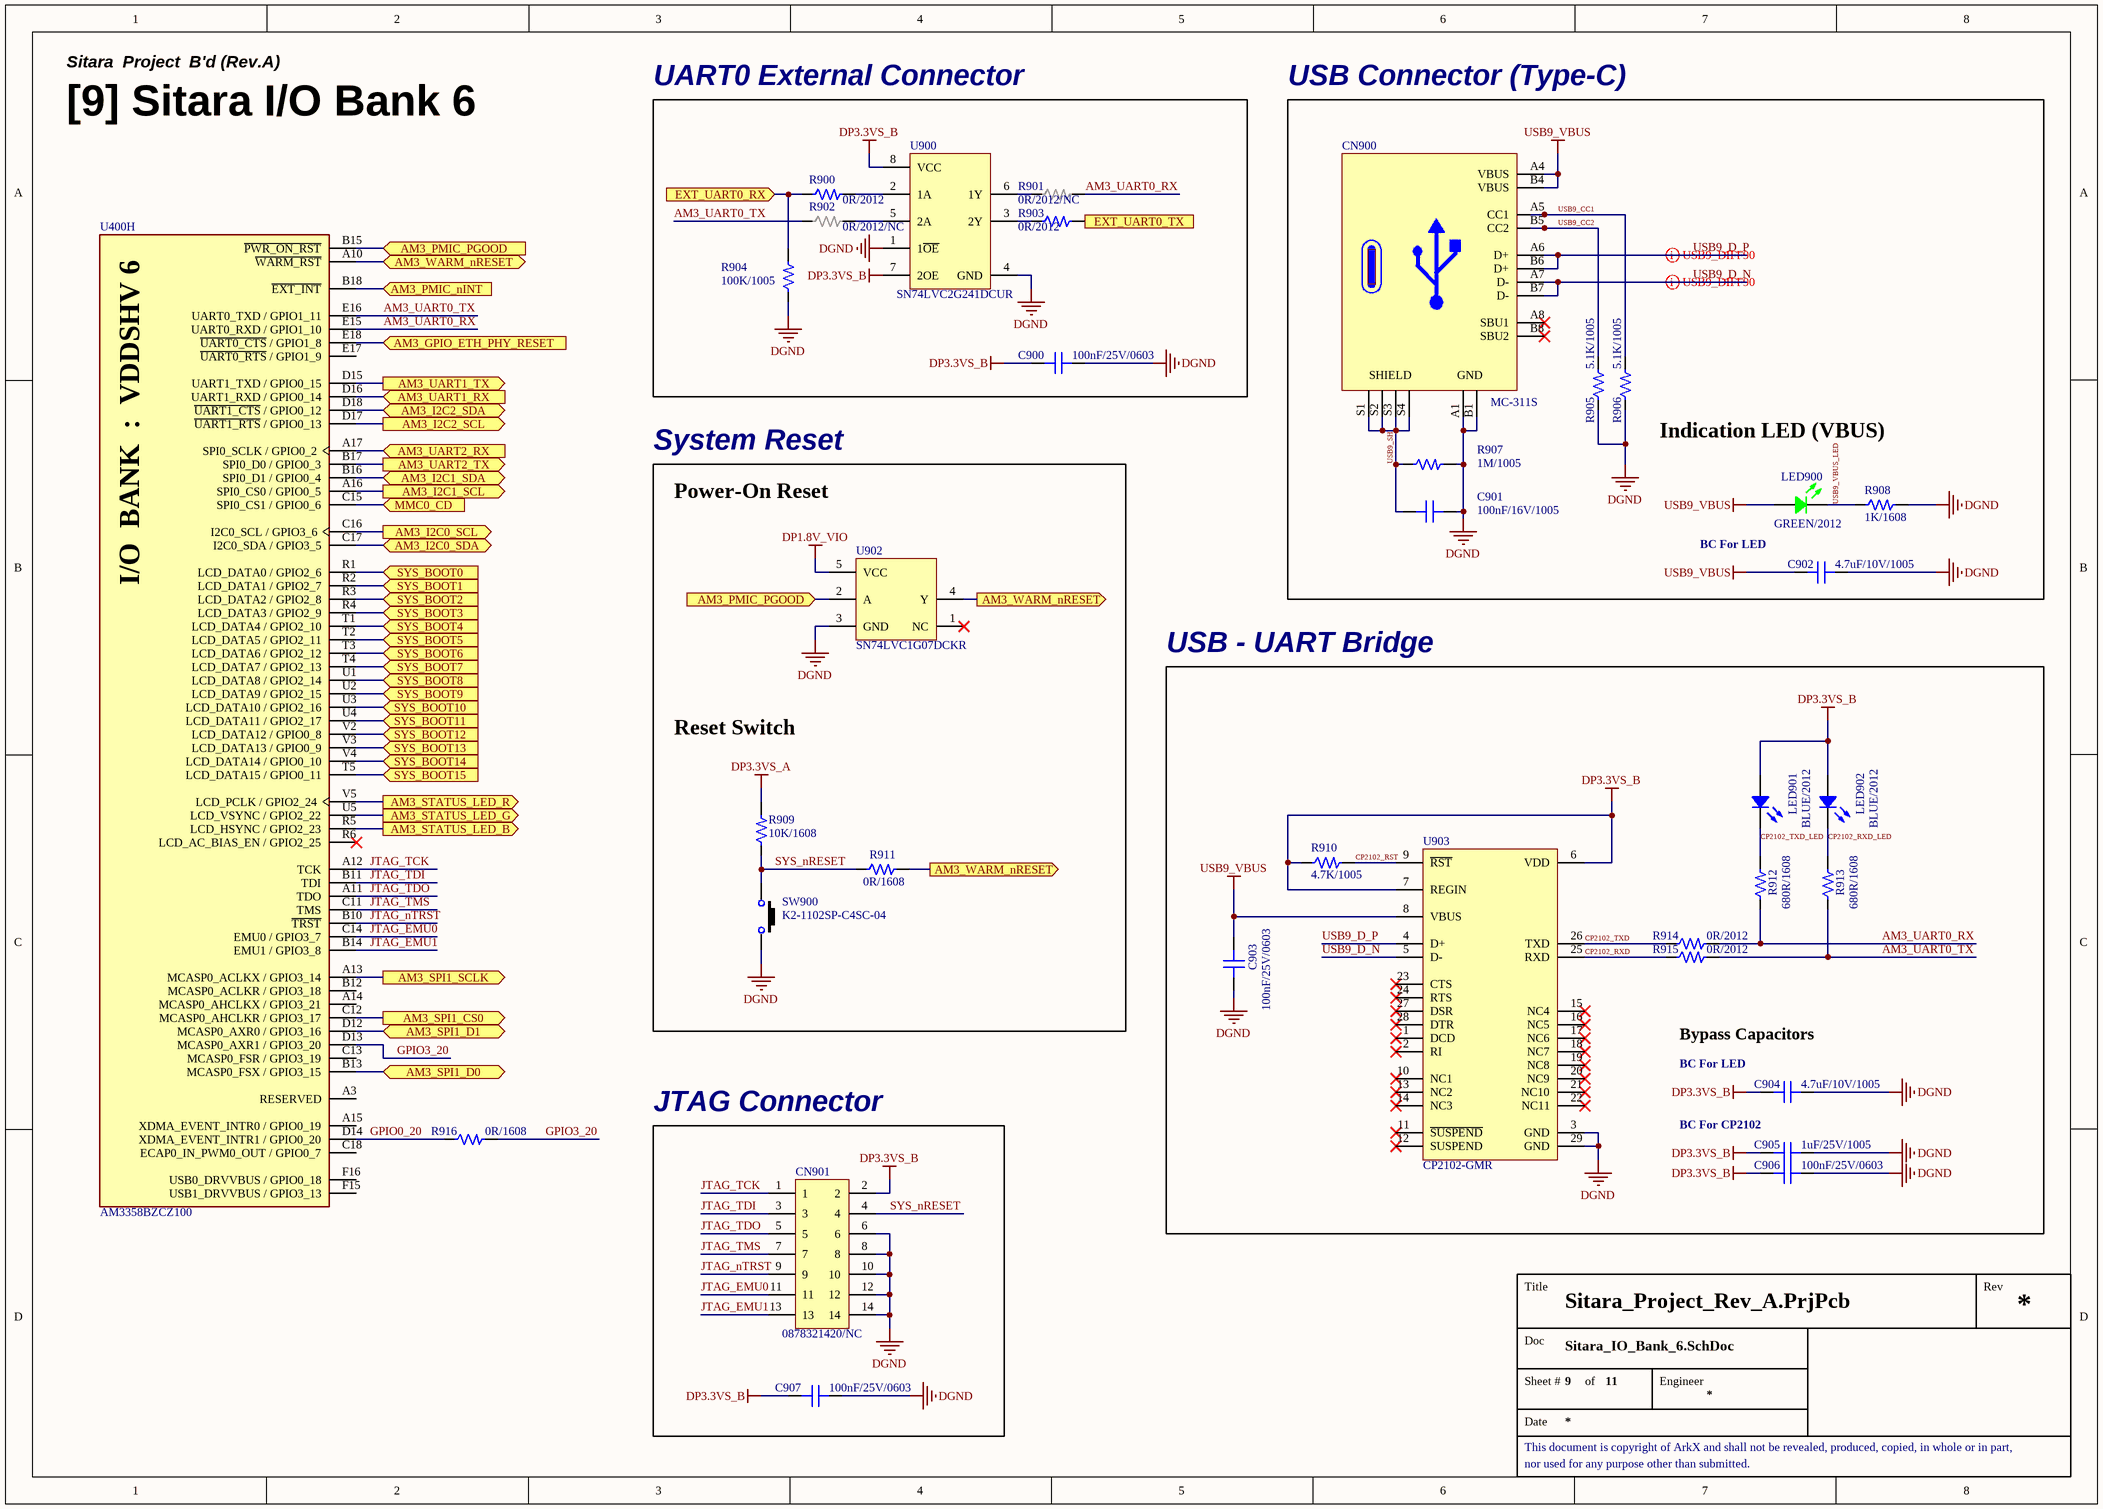
[diagram p8: Sitara_IO_Bank_6.SchDoc]

### Parts
C900  100nF/25V/0603  [CAP 0603 (0201_INCH)]
C901  100nF/16V/1005  [CAP 1005 (0402_INCH)]
C902  4.7uF/10V/1005  [CAP 1005 (0402_INCH)]
C903  100nF/25V/0603  [CAP 0603 (0201_INCH)]
C904  4.7uF/10V/1005  [CAP 1005 (0402_INCH)]
C905  1uF/25V/1005  [CAP 1005 (0402_INCH)]
C906  100nF/25V/0603  [CAP 0603 (0201_INCH)]
C907  100nF/25V/0603  [CAP 0603 (0201_INCH)]
CN900  MC-311S  [CON USB-Type-C (16P)]
CN901  0878321420/NC  [CON_NC_BOX_HEADER_DUAL_2x7PIN(2.00MM) (0878321420)]
LED900  GREEN/2012  [LED MHT170RGBCT (GREEN)]
LED901  BLUE/2012  [LED MHT170RGBCT (BLUE)]
LED902  BLUE/2012  [LED MHT170RGBCT (BLUE)]
R900  0R/2012  [RES 2012 (0805_inch)]
R901  0R/2012/NC  [RES 2012 (0805_INCH)/NC]
R902  0R/2012/NC  [RES 2012 (0805_INCH)/NC]
R903  0R/2012  [RES 2012 (0805_inch)]
R904  100K/1005  [RES 1005 (0402_inch)]
R905  5.1K/1005  [RES 1005 (0402_inch)]
R906  5.1K/1005  [RES 1005 (0402_inch)]
R907  1M/1005  [RES 1005 (0402_inch)]
R908  1K/1608  [RES 1608 (0603_inch)]
R909  10K/1608  [RES 1608 (0603_inch)]
R910  4.7K/1005  [RES 1005 (0402_inch)]
R911  0R/1608  [RES 1608 (0603_inch)]
R912  680R/1608  [RES 1608 (0603_inch)]
R913  680R/1608  [RES 1608 (0603_inch)]
R914  0R/2012  [RES 2012 (0805_inch)]
R915  0R/2012  [RES 2012 (0805_inch)]
R916  0R/1608  [RES 1608 (0603_inch)]
SW900  K2-1102SP-C4SC-04  [SW K2-1102SP-C4SC-04]
U400  AM3358BZCZ100  [IC_SOC_AM3358BZCZ100]  (part H of 8)
U900  SN74LVC2G241DCUR  [IC_VSSOP-8]
U902  SN74LVC1G07DCKR  [IC_SC-70-5]
U903  CP2102-GMR  [QFN-28 (5x5mm)]

### Blocks framed on the sheet
UART0 External Connector: C900 R900-R904 U900
USB Connector (Type-C): C901 C902 CN900 LED900 R905-R908
System Reset: R909 R911 SW900 U902
USB - UART Bridge: C903-C906 LED901 LED902 R910 R912-R915 U903
JTAG Connector: C907 CN901

### Ports
AM3_GPIO_ETH_PHY_RESET (in), AM3_I2C0_SCL (out), AM3_I2C0_SDA (bidir), AM3_I2C1_SCL (out), AM3_I2C1_SDA (bidir), AM3_I2C2_SCL (out), AM3_I2C2_SDA (bidir), AM3_PMIC_nINT (in), AM3_PMIC_PGOOD (in), AM3_SPI1_CS0 (out), AM3_SPI1_D0 (bidir), AM3_SPI1_D1 (bidir), AM3_SPI1_SCLK (out), AM3_STATUS_LED_B (out), AM3_STATUS_LED_G (out), AM3_STATUS_LED_R (out), AM3_UART1_RX (in), AM3_UART1_TX (out), AM3_UART2_RX (in), AM3_UART2_TX (out), AM3_WARM_nRESET (bidir), AM3_WARM_nRESET (out), EXT_UART0_RX (in), EXT_UART0_TX (out), MMC0_CD (in), SYS_BOOT0 (in), SYS_BOOT1 (in), SYS_BOOT2 (in), SYS_BOOT3 (in), SYS_BOOT4 (in), SYS_BOOT5 (in), SYS_BOOT6 (in), SYS_BOOT7 (in), SYS_BOOT8 (in), SYS_BOOT9 (in), SYS_BOOT10 (in), SYS_BOOT11 (in), SYS_BOOT12 (in), SYS_BOOT13 (in), SYS_BOOT14 (in), SYS_BOOT15 (in)

### Nets
DGND: C900.1 C901.1 C902.1 C903.2 C904.1 C905.2 C906.1 C907.1 CN900.A1(GND) CN900.B1(GND) CN901.6 CN901.8 CN901.10 CN901.12 CN901.14 R904.1 R905.1 R906.1 R907.2 R908.2 SW900.3 U900.1(1~{OE}) U900.4(GND) U902.3(GND) U903.3(GND) U903.29(GND)
DP1.8V_VIO: U902.5(VCC)
DP3.3VS_A: R909.2
DP3.3VS_B: C900.2 C904.2 C905.1 C906.2 C907.2 CN901.2 LED901.4(Common_Anode) LED902.4(Common_Anode) R910.1 U900.7(2OE) U900.8(VCC) U903.6(VDD) U903.7(REGIN)
USB9_VBUS: C902.2 C903.1 CN900.A4(VBUS) CN900.B4(VBUS) LED900.4(Common_Anode) U903.8(VBUS)
AM3_GPIO_ETH_PHY_RESET: U400.E18(~{UART0_CTS}_/_GPIO1_8) ; port AM3_GPIO_ETH_PHY_RESET
AM3_I2C0_SCL: U400.C16(I2C0_SCL_/_GPIO3_6) ; port AM3_I2C0_SCL
AM3_I2C0_SDA: U400.C17(I2C0_SDA_/_GPIO3_5) ; port AM3_I2C0_SDA
AM3_I2C1_SCL: U400.A16(SPI0_CS0_/_GPIO0_5) ; port AM3_I2C1_SCL
AM3_I2C1_SDA: U400.B16(SPI0_D1_/_GPIO0_4) ; port AM3_I2C1_SDA
AM3_I2C2_SCL: U400.D17(~{UART1_RTS}_/_GPIO0_13) ; port AM3_I2C2_SCL
AM3_I2C2_SDA: U400.D18(~{UART1_CTS}_/_GPIO0_12) ; port AM3_I2C2_SDA
AM3_PMIC_nINT: U400.B18(~{EXT_INT}) ; port AM3_PMIC_nINT
AM3_PMIC_PGOOD: U400.B15(~{PWR_ON_RST}) U902.2(A) ; port AM3_PMIC_PGOOD
AM3_SPI1_CS0: U400.C12(MCASP0_AHCLKR_/_GPIO3_17) ; port AM3_SPI1_CS0
AM3_SPI1_D0: U400.B13(MCASP0_FSX_/_GPIO3_15) ; port AM3_SPI1_D0
AM3_SPI1_D1: U400.D12(MCASP0_AXR0_/_GPIO3_16) ; port AM3_SPI1_D1
AM3_SPI1_SCLK: U400.A13(MCASP0_ACLKX_/_GPIO3_14) ; port AM3_SPI1_SCLK
AM3_STATUS_LED_B: U400.R5(LCD_HSYNC_/_GPIO2_23) ; port AM3_STATUS_LED_B
AM3_STATUS_LED_G: U400.U5(LCD_VSYNC_/_GPIO2_22) ; port AM3_STATUS_LED_G
AM3_STATUS_LED_R: U400.V5(LCD_PCLK_/_GPIO2_24) ; port AM3_STATUS_LED_R
AM3_UART0_RX: R901.2 R912.1 R914.2 U400.E15(UART0_RXD_/_GPIO1_10)
AM3_UART0_TX: R902.1 R913.1 R915.2 U400.E16(UART0_TXD_/_GPIO1_11)
AM3_UART1_RX: U400.D16(UART1_RXD_/_GPIO0_14) ; port AM3_UART1_RX
AM3_UART1_TX: U400.D15(UART1_TXD_/_GPIO0_15) ; port AM3_UART1_TX
AM3_UART2_RX: U400.A17(SPI0_SCLK_/_GPIO0_2) ; port AM3_UART2_RX
AM3_UART2_TX: U400.B17(SPI0_D0_/_GPIO0_3) ; port AM3_UART2_TX
AM3_WARM_nRESET: R911.2 U400.A10(~{WARM_RST}) U902.4(Y) ; port AM3_WARM_nRESET
CP2102_RST: R910.2 U903.9(~{RST})
CP2102_RXD: R915.1 U903.25(RXD)
CP2102_RXD_LED: LED902.3(BLUE) R913.2
CP2102_TXD: R914.1 U903.26(TXD)
CP2102_TXD_LED: LED901.3(BLUE) R912.2
EXT_UART0_RX: R900.1 R904.2 ; port EXT_UART0_RX
EXT_UART0_TX: R903.2 ; port EXT_UART0_TX
GPIO0_20: R916.1 U400.D14(XDMA_EVENT_INTR1_/_GPIO0_20)
GPIO3_20: R916.2 U400.D13(MCASP0_AXR1_/_GPIO3_20)
JTAG_EMU0: CN901.11 U400.C14(EMU0_/_GPIO3_7)
JTAG_EMU1: CN901.13 U400.B14(EMU1_/_GPIO3_8)
JTAG_nTRST: CN901.9 U400.B10(~{TRST})
JTAG_TCK: CN901.1 U400.A12(TCK)
JTAG_TDI: CN901.3 U400.B11(TDI)
JTAG_TDO: CN901.5 U400.A11(TDO)
JTAG_TMS: CN901.7 U400.C11(TMS)
MMC0_CD: U400.C15(SPI0_CS1_/_GPIO0_6) ; port MMC0_CD
SYS_BOOT0: U400.R1(LCD_DATA0_/_GPIO2_6) ; port SYS_BOOT0
SYS_BOOT1: U400.R2(LCD_DATA1_/_GPIO2_7) ; port SYS_BOOT1
SYS_BOOT2: U400.R3(LCD_DATA2_/_GPIO2_8) ; port SYS_BOOT2
SYS_BOOT3: U400.R4(LCD_DATA3_/_GPIO2_9) ; port SYS_BOOT3
SYS_BOOT4: U400.T1(LCD_DATA4_/_GPIO2_10) ; port SYS_BOOT4
SYS_BOOT5: U400.T2(LCD_DATA5_/_GPIO2_11) ; port SYS_BOOT5
SYS_BOOT6: U400.T3(LCD_DATA6_/_GPIO2_12) ; port SYS_BOOT6
SYS_BOOT7: U400.T4(LCD_DATA7_/_GPIO2_13) ; port SYS_BOOT7
SYS_BOOT8: U400.U1(LCD_DATA8_/_GPIO2_14) ; port SYS_BOOT8
SYS_BOOT9: U400.U2(LCD_DATA9_/_GPIO2_15) ; port SYS_BOOT9
SYS_BOOT10: U400.U3(LCD_DATA10_/_GPIO2_16) ; port SYS_BOOT10
SYS_BOOT11: U400.U4(LCD_DATA11_/_GPIO2_17) ; port SYS_BOOT11
SYS_BOOT12: U400.V2(LCD_DATA12_/_GPIO0_8) ; port SYS_BOOT12
SYS_BOOT13: U400.V3(LCD_DATA13_/_GPIO0_9) ; port SYS_BOOT13
SYS_BOOT14: U400.V4(LCD_DATA14_/_GPIO0_10) ; port SYS_BOOT14
SYS_BOOT15: U400.T5(LCD_DATA15_/_GPIO0_11) ; port SYS_BOOT15
SYS_nRESET: CN901.4 R909.1 R911.1 SW900.1
USB9_CC1: CN900.A5(CC1) R906.2
USB9_CC2: CN900.B5(CC2) R905.2
USB9_D_N: CN900.A7(D-) CN900.B7(D-) U903.5(D-)
USB9_D_P: CN900.A6(D+) CN900.B6(D+) U903.4(D+)
USB9_SH: C901.2 CN900.S1(SHIELD) CN900.S2(SHIELD) CN900.S3(SHIELD) CN900.S4(SHIELD) R907.1
USB9_VBUS_LED: LED900.2(GREEN) R908.1
NetR900_2: R900.2 U900.2(1A)
NetR901_1: R901.1 U900.6(1Y)
NetR902_2: R902.2 U900.5(2A)
NetR903_1: R903.1 U900.3(2Y)

Not connected (* = marked no-connect by the designer): CN900 A8(SBU1)* B8(SBU2)*; U400 A3(RESERVED) A14(MCASP0_AHCLKX_/_GPIO3_21) A15(XDMA_EVENT_INTR0_/_GPIO0_19) B12(MCASP0_ACLKR_/_GPIO3_18) C13(MCASP0_FSR_/_GPIO3_19) C18(ECAP0_IN_PWM0_OUT_/_GPIO0_7) E17(~{UART0_RTS}_/_GPIO1_9) F15(USB1_DRVVBUS_/_GPIO3_13) F16(USB0_DRVVBUS_/_GPIO0_18) R6(LCD_AC_BIAS_EN_/_GPIO2_25)*; U902 1(NC)*; U903 1(DCD)* 2(RI)* 10(NC1)* 11(~{SUSPEND})* 12(SUSPEND)* 13(NC2)* 14(NC3)* 15(NC4)* 16(NC5)* 17(NC6)* 18(NC7)* 19(NC8)* 20(NC9)* 21(NC10)* 22(NC11)* 23(CTS)* 24(RTS)* 27(DSR)* 28(DTR)*

### Layout directives
differential pair; differential pair class USB9_DIFF90: USB9_D_N, USB9_D_P

### Notes on the sheet
- Sitara  Project  B'd (Rev.A)
- [9] Sitara I/O Bank 6
- Indication LED (VBUS)
- Power-On Reset
- BC For LED
- Reset Switch
- Bypass Capacitors
- (near C904) BC For LED
- BC For CP2102
- Title
- Rev
- Doc
- Sheet #
- of
- Engineer
- This document is copyright of ArkX and shall not be revealed, produced, copied, in whole or in part,
- Date
- nor used for any purpose other than submitted.
- (in symbol IC_SOC_AM3358BZCZ100, part H) I/O  BANK  :  VDDSHV 6

### Library data of the parts
C900 C903 C906 C907 = CAP_100nF/25V/0603: Ceramic CAP_100nF/25V/0603; JLCPCB Part Type: Extended Part; LCSC Part #: C181047
C901 = CAP_100nF/16V/1005: Ceramic CAP_100nF/16V/1005; LCSC Part #: C1525; JLCPCB Part Type: Basic Part
C902 C904 = CAP_4.7uF/10V/1005: 10V 4.7uF X5R ±20% 0402  Multilayer Ceramic Capacitors MLCC - SMD/SMT ROHS; JLCPCB Part Type: Basic Part; LCSC Part #: C23733
C905 = CAP_1uF/25V/1005: Ceramic CAP_1uF/25V/1005; LCSC Part #: C52923; JLCPCB Part Type: Basic Part
CN900 = CON_USB-Type-C: USB 2.0 5A 1 Surface Mount 16 Female -35℃~+75℃ Type-C SMD  USB Connectors ROHS; LCSC Part #: C2977718; JLCPCB Part Type: Extended Part
CN901 = CON_NC_BOX_HEADER_DUAL_2x7PIN(2.00MM)_1: CONN HEADER SMD 14POS 2MM
LED900 = LED_MHT170RGBCT(GREEN): Colorless transparence -30℃~+85℃ Positive post Common anode RGB 120° 0805  Light Emitting Diodes (LED) ROHS; LCSC Part #: C2962094; JLCPCB Part Type: Extended Part
LED901 LED902 = LED_MHT170RGBCT(BLUE): Colorless transparence -30℃~+85℃ Positive post Common anode RGB 120° 0805  Light Emitting Diodes (LED) ROHS; LCSC Part #: C2962094; JLCPCB Part Type: Extended Part
R900 R903 R914 R915 = RES_0R/2012/0.125W: as R834 on sheet Sitara_IO_Bank_45; Size: 2012; LCSC Part #: C17477; JLCPCB Part Type: Basic Part
R901 R902 = RES_NC_0R/2012/0.125W: 0R/2012/0.125W/NC; Value: 0R; Power Rating: 0.1W; Precision: 1%; Size: 1608
R904 = RES_100K/1005/62.5mW: Value: 100K; Power Rating: 62.5mW; Precision: 1%; Size: 1005; LCSC Part #: C25741; JLCPCB Part Type: Basic Part
R905 R906 = RES_5.1K/1005/62.5mW: Value: 5.1K; Power Rating: 62.5mW; Precision: 1%; Size: 1005; LCSC Part #: C25905; JLCPCB Part Type: Basic Part
R907 = RES_1M/1005/62.5mW: Value: 1M; Power Rating: 62.5mW; Precision: 1%; Size: 1005; LCSC Part #: C26083; JLCPCB Part Type: Basic Part
R908 = RES_1K/1608/0.1W: Value: 1K; Power Rating: 0.1W; Precision: 1%; Size: 1608; LCSC Part #: C21190; JLCPCB Part Type: Basic Part
R909 = RES_10K/1608/0.1W: as R819 on sheet Sitara_IO_Bank_45; Size: 1608; LCSC Part #: C25804; JLCPCB Part Type: Basic Part
R910 = RES_4.7K/1005/62.5mW: Value: 4.7K; Power Rating: 62.5mW; Precision: 1%; Size: 1005; LCSC Part #: C25900; JLCPCB Part Type: Basic Part
R911 R916 = RES_0R/1608/0.1W: as R820 on sheet Sitara_IO_Bank_45; Size: 1608; LCSC Part #: C21189; JLCPCB Part Type: Basic Part
R912 R913 = RES_680R/1608/0.1W: Value: 680R; Power Rating: 0.1W; Precision: 1%; Size: 1608; LCSC Part #: C23228; JLCPCB Part Type: Basic Part
SW900 = SW_K2-1102SP-C4SC-04(2P): -25℃~+85℃ 6mm 5mm Round Button 50mA Brick nogging 6mm SPST 100MΩ 100000 250gf@±30gf 12V SMD  Tactile Switches ROHS; LCSC Part #: C127509; JLCPCB Part Type: Extended Part
U400 = IC_SOC_AM3358BZCZ100: as U400 on sheet Sitara_IO_Bank_45; LCSC Part #: C73932; JLCPCB Part Type: Extended Part
U900 = IC_BUF_SN74LVC2G241DCUR: Buffer, Non-Inverting 2 Element 1 Bit per Element 3-State Output 8-VSSOP; LCSC Part #: C10430; JLCPCB Part Type: Extended Part
U902 = IC_BUF_SN74LVC1G07DCKR: Buffer, Non-Inverting 1 Element 1 Bit per Element Open Drain Output SC-70-5; LCSC Part #: C7830; JLCPCB Part Type: Extended Part
U903 = IC_USB_CP2102: Transceiver 1Mbps USB 1/1 QFN-28_5x5x05P  USB ICs ROHS; LCSC Part #: C6568; JLCPCB Part Type: Basic Part

## Sheet Sitara_Connectors.SchDoc
size A4; SheetNumber: 10; SheetTotal: 11
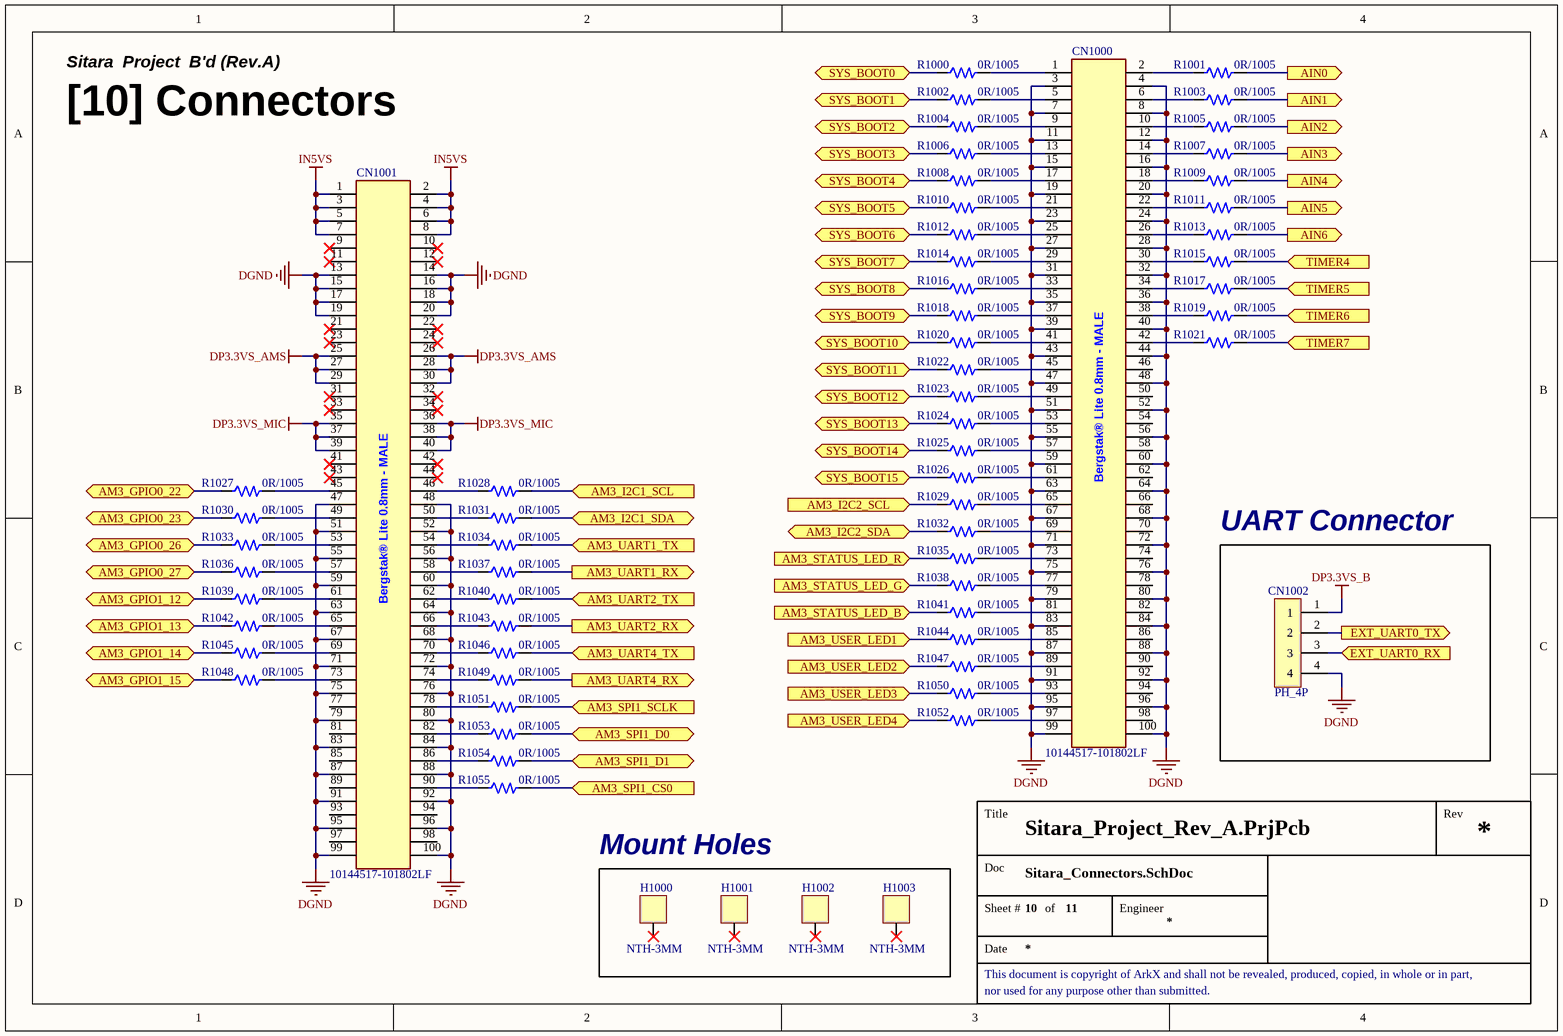
[diagram p9: Sitara_Connectors.SchDoc]

### Parts
CN1000  10144517-101802LF  [CON_BergStak-Lite(0.8mm)_MALE-100P(10144517-101802LF)_HandSolder]
CN1001  10144517-101802LF  [CON_BergStak-Lite(0.8mm)_MALE-100P(10144517-101802LF)_HandSolder]
CN1002  PH_4P  [CON PIN_HEADER-4PIN(2.54MM)]
H1000  NTH-3MM  [HOLE NTH-3MM]
H1001  NTH-3MM  [HOLE NTH-3MM]
H1002  NTH-3MM  [HOLE NTH-3MM]
H1003  NTH-3MM  [HOLE NTH-3MM]
R1000  0R/1005  [RES 1005 (0402_inch)]
R1001  0R/1005  [RES 1005 (0402_inch)]
R1002  0R/1005  [RES 1005 (0402_inch)]
R1003  0R/1005  [RES 1005 (0402_inch)]
R1004  0R/1005  [RES 1005 (0402_inch)]
R1005  0R/1005  [RES 1005 (0402_inch)]
R1006  0R/1005  [RES 1005 (0402_inch)]
R1007  0R/1005  [RES 1005 (0402_inch)]
R1008  0R/1005  [RES 1005 (0402_inch)]
R1009  0R/1005  [RES 1005 (0402_inch)]
R1010  0R/1005  [RES 1005 (0402_inch)]
R1011  0R/1005  [RES 1005 (0402_inch)]
R1012  0R/1005  [RES 1005 (0402_inch)]
R1013  0R/1005  [RES 1005 (0402_inch)]
R1014  0R/1005  [RES 1005 (0402_inch)]
R1015  0R/1005  [RES 1005 (0402_inch)]
R1016  0R/1005  [RES 1005 (0402_inch)]
R1017  0R/1005  [RES 1005 (0402_inch)]
R1018  0R/1005  [RES 1005 (0402_inch)]
R1019  0R/1005  [RES 1005 (0402_inch)]
R1020  0R/1005  [RES 1005 (0402_inch)]
R1021  0R/1005  [RES 1005 (0402_inch)]
R1022  0R/1005  [RES 1005 (0402_inch)]
R1023  0R/1005  [RES 1005 (0402_inch)]
R1024  0R/1005  [RES 1005 (0402_inch)]
R1025  0R/1005  [RES 1005 (0402_inch)]
R1026  0R/1005  [RES 1005 (0402_inch)]
R1027  0R/1005  [RES 1005 (0402_inch)]
R1028  0R/1005  [RES 1005 (0402_inch)]
R1029  0R/1005  [RES 1005 (0402_inch)]
R1030  0R/1005  [RES 1005 (0402_inch)]
R1031  0R/1005  [RES 1005 (0402_inch)]
R1032  0R/1005  [RES 1005 (0402_inch)]
R1033  0R/1005  [RES 1005 (0402_inch)]
R1034  0R/1005  [RES 1005 (0402_inch)]
R1035  0R/1005  [RES 1005 (0402_inch)]
R1036  0R/1005  [RES 1005 (0402_inch)]
R1037  0R/1005  [RES 1005 (0402_inch)]
R1038  0R/1005  [RES 1005 (0402_inch)]
R1039  0R/1005  [RES 1005 (0402_inch)]
R1040  0R/1005  [RES 1005 (0402_inch)]
R1041  0R/1005  [RES 1005 (0402_inch)]
R1042  0R/1005  [RES 1005 (0402_inch)]
R1043  0R/1005  [RES 1005 (0402_inch)]
R1044  0R/1005  [RES 1005 (0402_inch)]
R1045  0R/1005  [RES 1005 (0402_inch)]
R1046  0R/1005  [RES 1005 (0402_inch)]
R1047  0R/1005  [RES 1005 (0402_inch)]
R1048  0R/1005  [RES 1005 (0402_inch)]
R1049  0R/1005  [RES 1005 (0402_inch)]
R1050  0R/1005  [RES 1005 (0402_inch)]
R1051  0R/1005  [RES 1005 (0402_inch)]
R1052  0R/1005  [RES 1005 (0402_inch)]
R1053  0R/1005  [RES 1005 (0402_inch)]
R1054  0R/1005  [RES 1005 (0402_inch)]
R1055  0R/1005  [RES 1005 (0402_inch)]

### Blocks framed on the sheet
UART Connector: CN1002
Mount Holes: H1000-H1003

### Ports
AIN0 (out), AIN1 (out), AIN2 (out), AIN3 (out), AIN4 (out), AIN5 (out), AIN6 (out), AM3_GPIO0_22 (bidir), AM3_GPIO0_23 (bidir), AM3_GPIO0_26 (bidir), AM3_GPIO0_27 (bidir), AM3_GPIO1_12 (bidir), AM3_GPIO1_13 (bidir), AM3_GPIO1_14 (bidir), AM3_GPIO1_15 (bidir), AM3_I2C1_SCL (in), AM3_I2C1_SDA (bidir), AM3_I2C2_SCL (in), AM3_I2C2_SDA (bidir), AM3_SPI1_CS0 (in), AM3_SPI1_D0 (bidir), AM3_SPI1_D1 (bidir), AM3_SPI1_SCLK (in), AM3_STATUS_LED_B (in), AM3_STATUS_LED_G (in), AM3_STATUS_LED_R (in), AM3_UART1_RX (out), AM3_UART1_TX (in), AM3_UART2_RX (out), AM3_UART2_TX (in), AM3_UART4_RX (out), AM3_UART4_TX (in), AM3_USER_LED1 (in), AM3_USER_LED2 (in), AM3_USER_LED3 (in), AM3_USER_LED4 (in), EXT_UART0_RX (in), EXT_UART0_TX (out), SYS_BOOT0 (bidir), SYS_BOOT1 (bidir), SYS_BOOT2 (bidir), SYS_BOOT3 (bidir), SYS_BOOT4 (bidir), SYS_BOOT5 (bidir), SYS_BOOT6 (bidir), SYS_BOOT7 (bidir), SYS_BOOT8 (bidir), SYS_BOOT9 (bidir), SYS_BOOT10 (bidir), SYS_BOOT11 (bidir), SYS_BOOT12 (bidir), SYS_BOOT13 (bidir), SYS_BOOT14 (bidir), SYS_BOOT15 (bidir), TIMER4 (in), TIMER5 (in), TIMER6 (in), TIMER7 (in)

### Nets
DGND: CN1000.3 CN1000.4 CN1000.7 CN1000.8 CN1000.11 CN1000.12 CN1000.15 CN1000.16 CN1000.19 CN1000.20 CN1000.23 CN1000.24 CN1000.27 CN1000.28 CN1000.31 CN1000.32 CN1000.35 CN1000.36 CN1000.39 CN1000.40 CN1000.43 CN1000.44 CN1000.47 CN1000.48 CN1000.51 CN1000.52 CN1000.55 CN1000.56 CN1000.59 CN1000.60 CN1000.63 CN1000.64 CN1000.67 CN1000.68 CN1000.71 CN1000.72 CN1000.75 CN1000.76 CN1000.79 CN1000.80 CN1000.83 CN1000.84 CN1000.87 CN1000.88 CN1000.91 CN1000.92 CN1000.95 CN1000.96 CN1000.99 CN1000.100 CN1001.13 CN1001.14 CN1001.15 CN1001.16 CN1001.17 CN1001.18 CN1001.19 CN1001.20 CN1001.47 CN1001.48 CN1001.51 CN1001.52 CN1001.55 CN1001.56 CN1001.59 CN1001.60 CN1001.63 CN1001.64 CN1001.67 CN1001.68 CN1001.71 CN1001.72 CN1001.75 CN1001.76 CN1001.79 CN1001.80 CN1001.83 CN1001.84 CN1001.87 CN1001.88 CN1001.91 CN1001.92 CN1001.95 CN1001.96 CN1001.99 CN1001.100 CN1002.4
DP3.3VS_AMS: CN1001.25 CN1001.26 CN1001.27 CN1001.28 CN1001.29 CN1001.30
DP3.3VS_B: CN1002.1
DP3.3VS_MIC: CN1001.35 CN1001.36 CN1001.37 CN1001.38 CN1001.39 CN1001.40
IN5VS: CN1001.1 CN1001.2 CN1001.3 CN1001.4 CN1001.5 CN1001.6 CN1001.7 CN1001.8
AIN0: R1001.2 ; port AIN0
AIN1: R1003.2 ; port AIN1
AIN2: R1005.2 ; port AIN2
AIN3: R1007.2 ; port AIN3
AIN4: R1009.2 ; port AIN4
AIN5: R1011.2 ; port AIN5
AIN6: R1013.2 ; port AIN6
AM3_GPIO0_22: R1027.1 ; port AM3_GPIO0_22
AM3_GPIO0_23: R1030.1 ; port AM3_GPIO0_23
AM3_GPIO0_26: R1033.1 ; port AM3_GPIO0_26
AM3_GPIO0_27: R1036.1 ; port AM3_GPIO0_27
AM3_GPIO1_12: R1039.1 ; port AM3_GPIO1_12
AM3_GPIO1_13: R1042.1 ; port AM3_GPIO1_13
AM3_GPIO1_14: R1045.1 ; port AM3_GPIO1_14
AM3_GPIO1_15: R1048.1 ; port AM3_GPIO1_15
AM3_I2C1_SCL: R1028.2 ; port AM3_I2C1_SCL
AM3_I2C1_SDA: R1031.2 ; port AM3_I2C1_SDA
AM3_I2C2_SCL: R1029.1 ; port AM3_I2C2_SCL
AM3_I2C2_SDA: R1032.1 ; port AM3_I2C2_SDA
AM3_SPI1_CS0: R1055.2 ; port AM3_SPI1_CS0
AM3_SPI1_D0: R1053.2 ; port AM3_SPI1_D0
AM3_SPI1_D1: R1054.2 ; port AM3_SPI1_D1
AM3_SPI1_SCLK: R1051.2 ; port AM3_SPI1_SCLK
AM3_STATUS_LED_B: R1041.1 ; port AM3_STATUS_LED_B
AM3_STATUS_LED_G: R1038.1 ; port AM3_STATUS_LED_G
AM3_STATUS_LED_R: R1035.1 ; port AM3_STATUS_LED_R
AM3_UART1_RX: R1037.2 ; port AM3_UART1_RX
AM3_UART1_TX: R1034.2 ; port AM3_UART1_TX
AM3_UART2_RX: R1043.2 ; port AM3_UART2_RX
AM3_UART2_TX: R1040.2 ; port AM3_UART2_TX
AM3_UART4_RX: R1049.2 ; port AM3_UART4_RX
AM3_UART4_TX: R1046.2 ; port AM3_UART4_TX
AM3_USER_LED1: R1044.1 ; port AM3_USER_LED1
AM3_USER_LED2: R1047.1 ; port AM3_USER_LED2
AM3_USER_LED3: R1050.1 ; port AM3_USER_LED3
AM3_USER_LED4: R1052.1 ; port AM3_USER_LED4
EXT_UART0_RX: CN1002.3 ; port EXT_UART0_RX
EXT_UART0_TX: CN1002.2 ; port EXT_UART0_TX
SYS_BOOT0: R1000.1 ; port SYS_BOOT0
SYS_BOOT1: R1002.1 ; port SYS_BOOT1
SYS_BOOT2: R1004.1 ; port SYS_BOOT2
SYS_BOOT3: R1006.1 ; port SYS_BOOT3
SYS_BOOT4: R1008.1 ; port SYS_BOOT4
SYS_BOOT5: R1010.1 ; port SYS_BOOT5
SYS_BOOT6: R1012.1 ; port SYS_BOOT6
SYS_BOOT7: R1014.1 ; port SYS_BOOT7
SYS_BOOT8: R1016.1 ; port SYS_BOOT8
SYS_BOOT9: R1018.1 ; port SYS_BOOT9
SYS_BOOT10: R1020.1 ; port SYS_BOOT10
SYS_BOOT11: R1022.1 ; port SYS_BOOT11
SYS_BOOT12: R1023.1 ; port SYS_BOOT12
SYS_BOOT13: R1024.1 ; port SYS_BOOT13
SYS_BOOT14: R1025.1 ; port SYS_BOOT14
SYS_BOOT15: R1026.1 ; port SYS_BOOT15
TIMER4: R1015.2 ; port TIMER4
TIMER5: R1017.2 ; port TIMER5
TIMER6: R1019.2 ; port TIMER6
TIMER7: R1021.2 ; port TIMER7
NetCN1000_1: CN1000.1 R1000.2
NetCN1000_2: CN1000.2 R1001.1
NetCN1000_5: CN1000.5 R1002.2
NetCN1000_6: CN1000.6 R1003.1
NetCN1000_9: CN1000.9 R1004.2
NetCN1000_10: CN1000.10 R1005.1
NetCN1000_13: CN1000.13 R1006.2
NetCN1000_14: CN1000.14 R1007.1
NetCN1000_17: CN1000.17 R1008.2
NetCN1000_18: CN1000.18 R1009.1
NetCN1000_21: CN1000.21 R1010.2
NetCN1000_22: CN1000.22 R1011.1
NetCN1000_25: CN1000.25 R1012.2
NetCN1000_26: CN1000.26 R1013.1
NetCN1000_29: CN1000.29 R1014.2
NetCN1000_30: CN1000.30 R1015.1
NetCN1000_33: CN1000.33 R1016.2
NetCN1000_34: CN1000.34 R1017.1
NetCN1000_37: CN1000.37 R1018.2
NetCN1000_38: CN1000.38 R1019.1
NetCN1000_41: CN1000.41 R1020.2
NetCN1000_42: CN1000.42 R1021.1
NetCN1000_45: CN1000.45 R1022.2
NetCN1000_49: CN1000.49 R1023.2
NetCN1000_53: CN1000.53 R1024.2
NetCN1000_57: CN1000.57 R1025.2
NetCN1000_61: CN1000.61 R1026.2
NetCN1000_65: CN1000.65 R1029.2
NetCN1000_69: CN1000.69 R1032.2
NetCN1000_73: CN1000.73 R1035.2
NetCN1000_77: CN1000.77 R1038.2
NetCN1000_81: CN1000.81 R1041.2
NetCN1000_85: CN1000.85 R1044.2
NetCN1000_89: CN1000.89 R1047.2
NetCN1000_93: CN1000.93 R1050.2
NetCN1000_97: CN1000.97 R1052.2
NetCN1001_45: CN1001.45 R1027.2
NetCN1001_46: CN1001.46 R1028.1
NetCN1001_49: CN1001.49 R1030.2
NetCN1001_50: CN1001.50 R1031.1
NetCN1001_53: CN1001.53 R1033.2
NetCN1001_54: CN1001.54 R1034.1
NetCN1001_57: CN1001.57 R1036.2
NetCN1001_58: CN1001.58 R1037.1
NetCN1001_61: CN1001.61 R1039.2
NetCN1001_62: CN1001.62 R1040.1
NetCN1001_65: CN1001.65 R1042.2
NetCN1001_66: CN1001.66 R1043.1
NetCN1001_69: CN1001.69 R1045.2
NetCN1001_70: CN1001.70 R1046.1
NetCN1001_73: CN1001.73 R1048.2
NetCN1001_74: CN1001.74 R1049.1
NetCN1001_78: CN1001.78 R1051.1
NetCN1001_82: CN1001.82 R1053.1
NetCN1001_86: CN1001.86 R1054.1
NetCN1001_90: CN1001.90 R1055.1

Not connected (* = marked no-connect by the designer): CN1000 46 50 54 58 62 66 70 74 78 82 86 90 94 98; CN1001 9* 10* 11* 12* 21* 22* 23* 24* 31* 32* 33* 34* 41* 42* 43* 44* 77 81 85 89 93 94 97 98; H1000 1*; H1001 1*; H1002 1*; H1003 1*

### Notes on the sheet
- Sitara  Project  B'd (Rev.A)
- [10] Connectors
- Title
- Rev
- Doc
- Sheet #
- of
- Engineer
- This document is copyright of ArkX and shall not be revealed, produced, copied, in whole or in part,
- Date
- nor used for any purpose other than submitted.
- (in symbol CON_BergStak-Lite(0.8mm)_MALE-100P(10144517-101802LF)) Bergstak® Lite 0.8mm - MALE

### Library data of the parts
CN1000 CN1001 = CON_BergStak-Lite(0.8mm)_MALE-100P(10144517-101802LF): JLCPCB Part Type: Extended Part
CN1002 = CON_PIN_HEADER_SINGLE-4PIN(2.54MM)
H1000-H1003 = HOLE_NTH-3MM: Non-Through Hole 3mm
R1000-R1055 = RES_0R/1005/62.5mW: as R817 on sheet Sitara_IO_Bank_45; Size: 1005; LCSC Part #: C17168; JLCPCB Part Type: Basic Part

## Sheet Sch_Design_Check_List.SchDoc
size A4; SheetNumber: 11; SheetTotal: 10
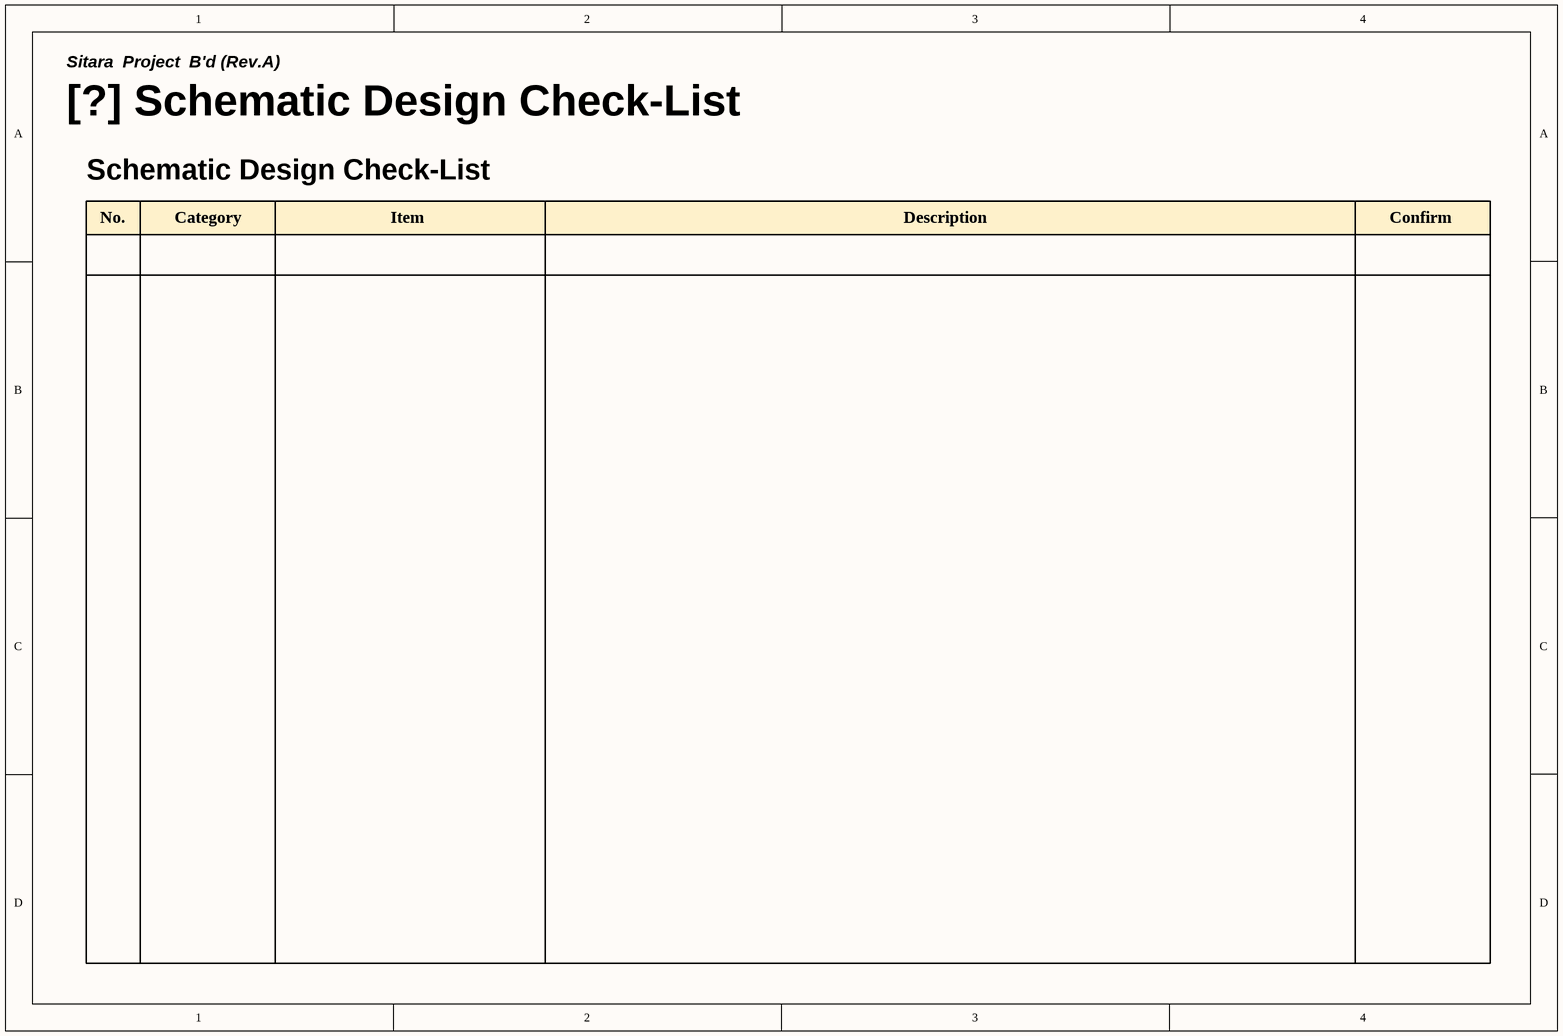
[diagram p10: Sch_Design_Check_List.SchDoc]

### Notes on the sheet
- Sitara  Project  B'd (Rev.A)
- [?] Schematic Design Check-List
- Schematic Design Check-List
- No.
- Category
- Item
- Description
- Confirm
- Title
- Rev
- Doc
- Sheet #
- of
- Engineer
- This document is copyright of ArkX and shall not be revealed, produced, copied, in whole or in part,
- Date
- nor used for any purpose other than submitted.